# EAGLE design datalogger_1.1 (EAGLE 5.12)
DATABASE: /home/matthew/work/eagle/partsdb.txt; PARTNO: HSMH-C170
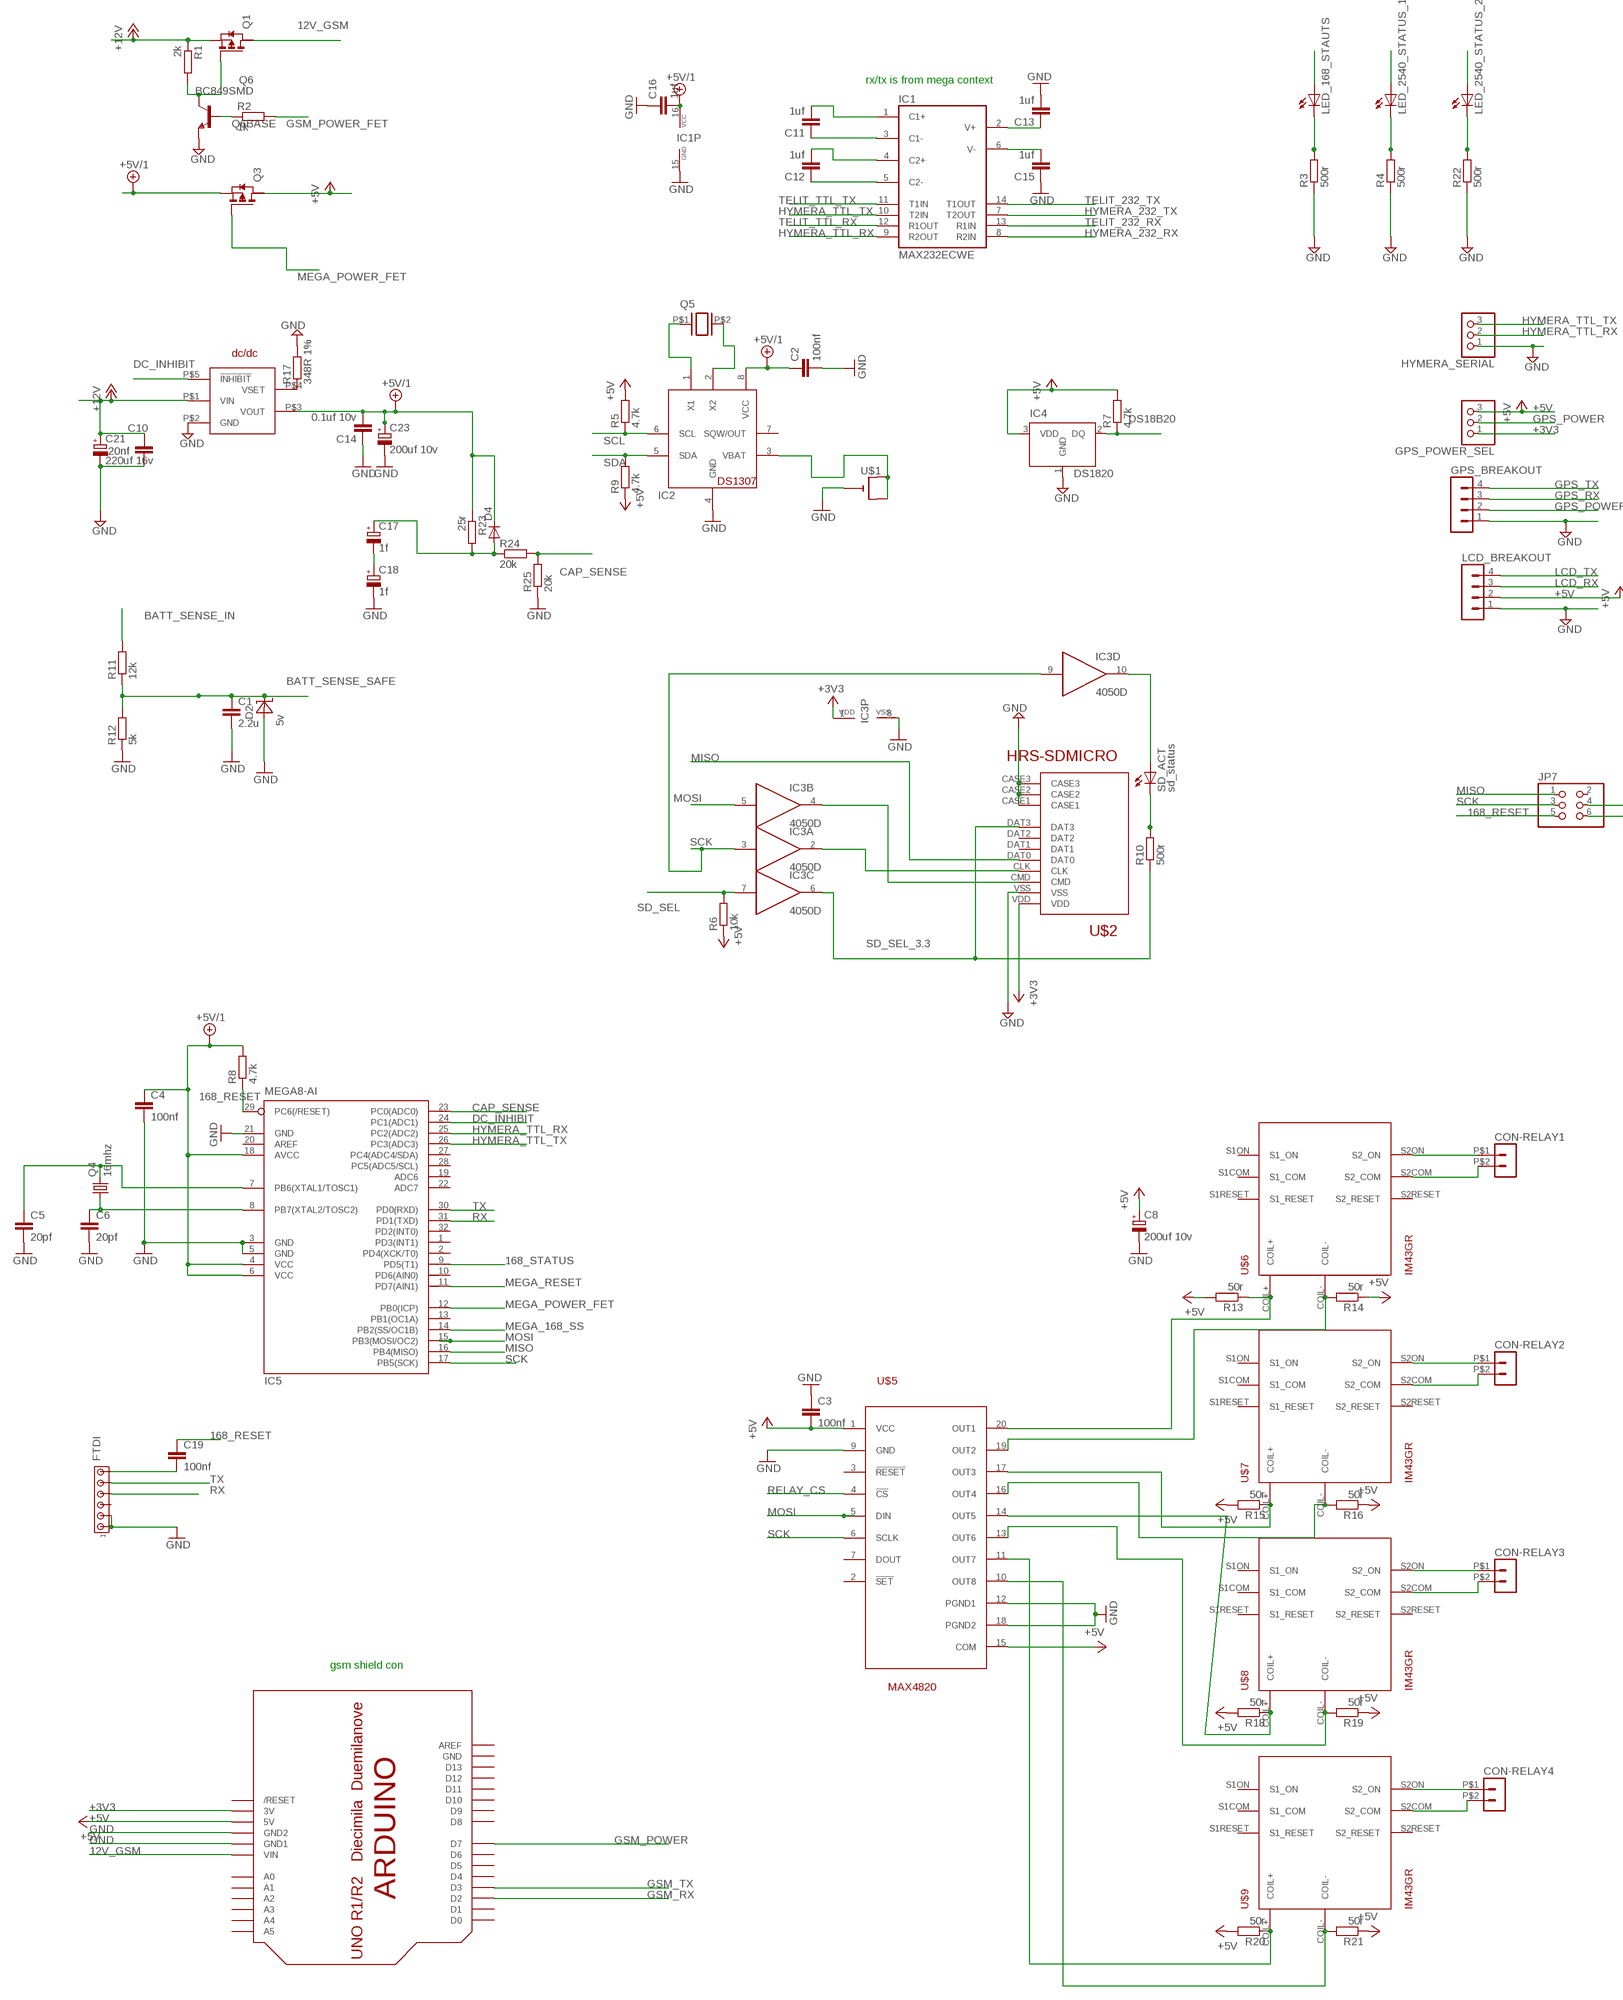
[diagram p0: schematic, sheet 1, part 1 of 3]
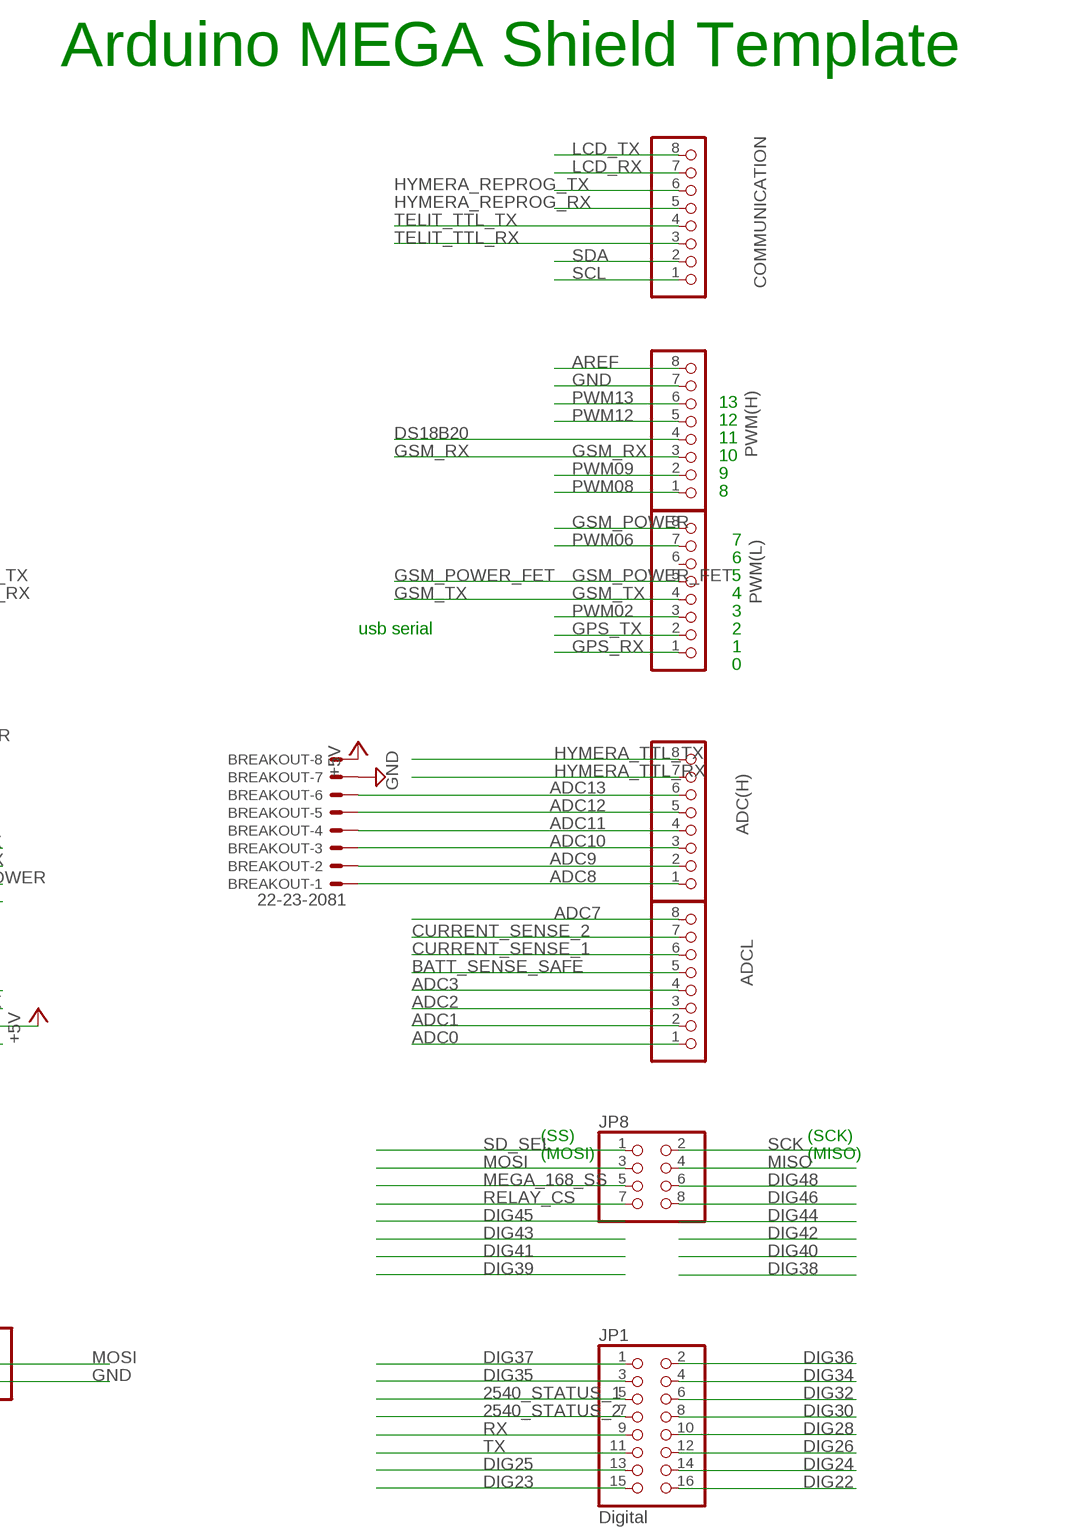
[diagram p1: schematic, sheet 1, part 2 of 3]
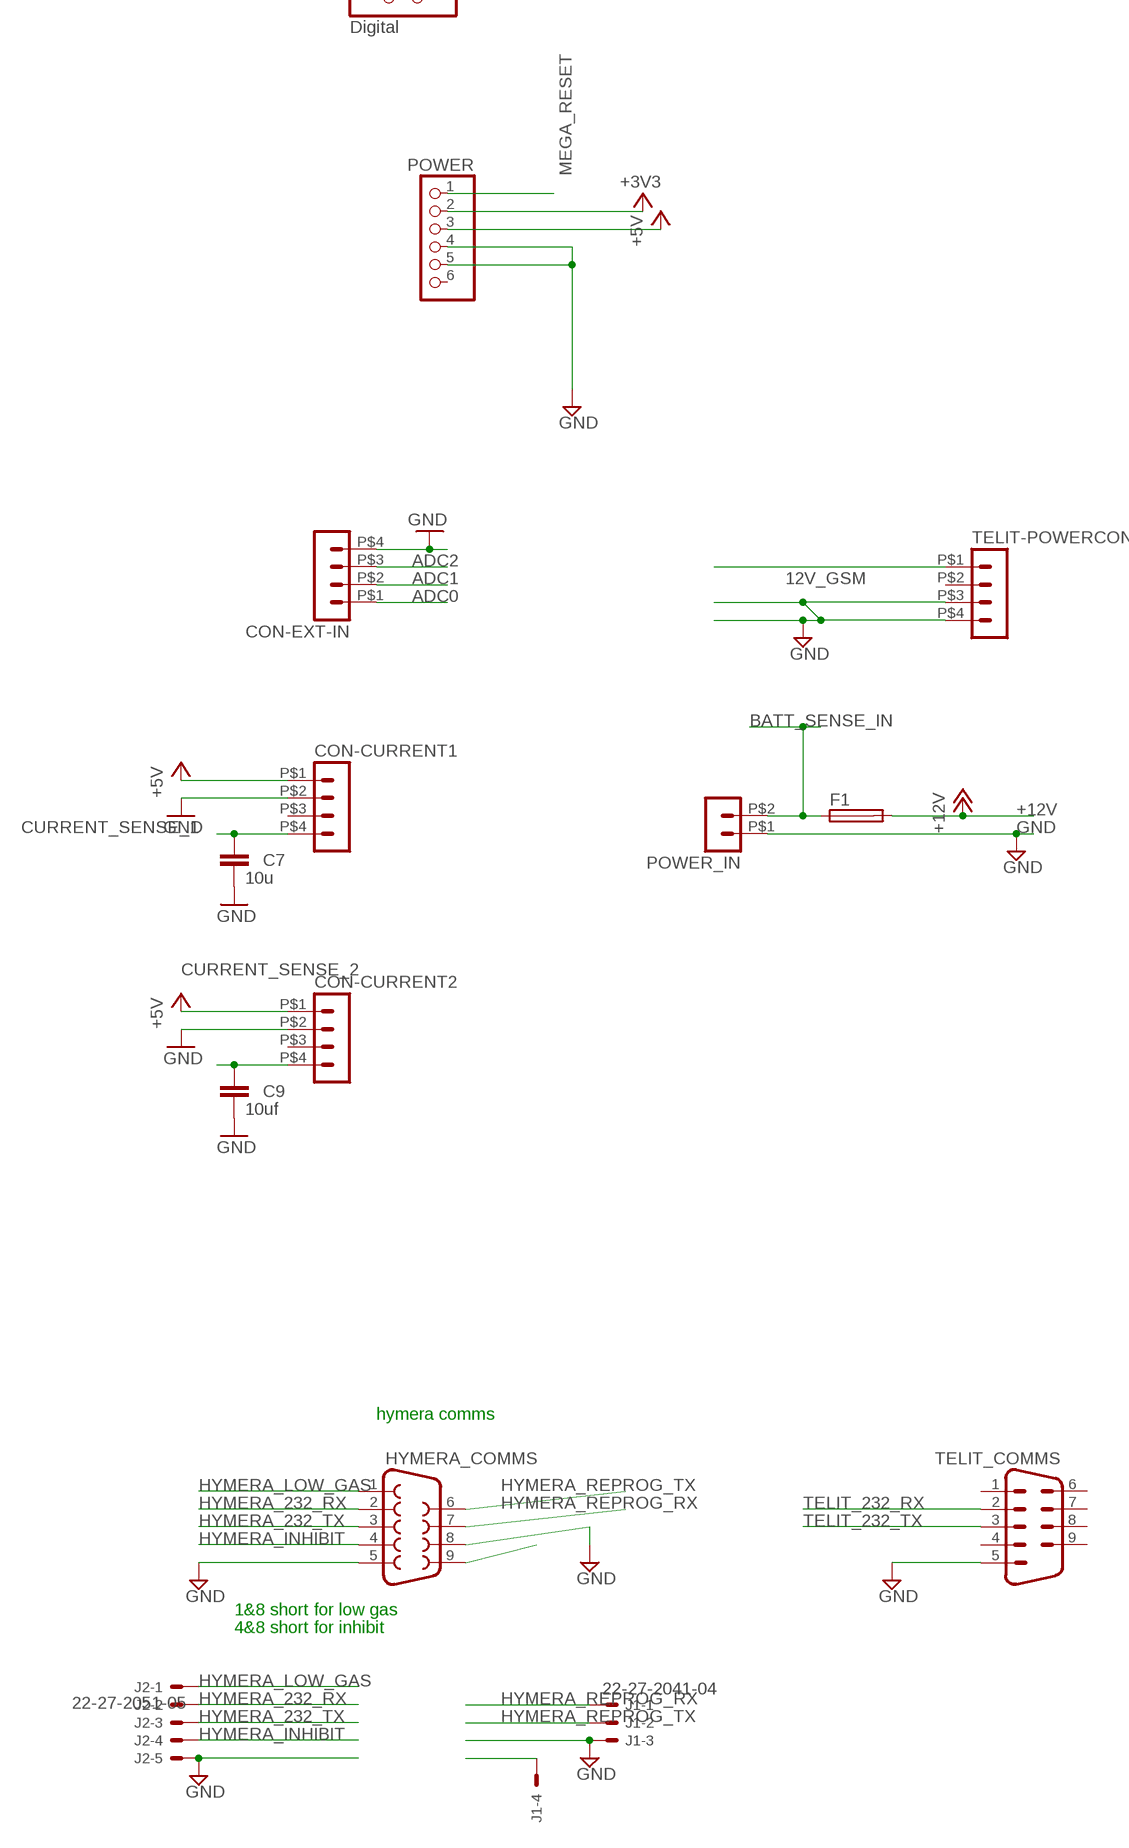
[diagram p2: schematic, sheet 1, part 3 of 3]

## Parts
ADC(H)  PINHD-1X8  [1X08]
ADCL  PINHD-1X8  [1X08]
BREAKOUT  22-23-2081  [22-23-2081]
C1  2.2u  C-EUC1206  [C1206]
C2  100nf  C-EUC1206  [C1206]
C3  100nf  C-EUC1206  [C1206]
C4  100nf  C-EUC1206  [C1206]
C5  20pf  C-EUC1206  [C1206]
C6  20pf  C-EUC1206  [C1206]
C7  10u  C-EUC1206  [C1206]
C8  200uf 10v  CPOL-EU153CLV-0505  [153CLV-0505]
C9  10uf  C-EUC1206  [C1206]
C10  20nf  C-EUC1206  [C1206]
C11  1uf  C-EUC1206  [C1206]
C12  1uf  C-EUC1206  [C1206]
C13  1uf  C-EUC1206  [C1206]
C14  0.1uf 10v  C-EUC1206  [C1206]
C15  1uf  C-EUC1206  [C1206]
C16  1uf  C-EUC1206  [C1206]
C17  1f  CPOL-EUE5-10.5  [E5-10,5]
C18  1f  CPOL-EUE5-10.5  [E5-10,5]
C19  100nf  C-EUC1206  [C1206]
C21  220uf 16v  CPOL-EU153CLV-0810  [153CLV-0810]
C23  200uf 10v  CPOL-EU153CLV-0505  [153CLV-0505]
COMMUNICATION  PINHD-1X8  [1X08]
CON-CURRENT1  HEADER_POS4_43045-0401  [43045-0400]
CON-CURRENT2  HEADER_POS4_43045-0401  [43045-0400]
CON-EXT-IN  HEADER_POS4_43045-0401  [43045-0400]
CON-RELAY1  HEADER_POS2_43045-0200  [43045-0200]
CON-RELAY2  HEADER_POS2_43045-0200  [43045-0200]
CON-RELAY3  HEADER_POS2_43045-0200  [43045-0200]
CON-RELAY4  HEADER_POS2_43045-0200  [43045-0200]
D2  5v  1206ZENER  [C1206]
D4  DIODE-DO214BA  [DO214BA]
F1  SH22,5  [SH22,5]
FTDI  MTA06-100  [10X06MTA]
GPS_BREAKOUT  MA04-1  [MA04-1]
GPS_POWER_SEL  PINHD-1X3  [1X03]
HYMERA_COMMS  F09H  [F09H]
HYMERA_SERIAL  PINHD-1X3  [1X03]
IC1  MAX232ECWE  [SO16L]
IC2  DS1307  DS1307SOO8  [SO08]
IC3  4050D  [SO16]
IC4  DS1820  [TO-92]
IC5  MEGA8-AI  [TQFP32-08]
J1  22-27-2041-04  [6410-04]
J2  22-27-2051-05  [6410-05]
JP1  Digital  PINHD-2X8  [2X08]
JP7  PINHD-2X3  [2X03]
JP8  PINHD-2X4  [2X04]
LCD_BREAKOUT  MA04-1  [MA04-1]
LED_168_STAUTS  sd_status  LEDSMT1206  [1206]
LED_2540_STATUS_1  sd_status  LEDSMT1206  [1206]
LED_2540_STATUS_2  sd_status  LEDSMT1206  [1206]
POWER  PINHD-1X6  [1X06]
POWER_IN  HEADER_POS2_43045-0200  [43045-0200]
PWM(H)  PINHD-1X8  [1X08]
PWM(L)  PINHD-1X8  [1X08]
Q1  PMOSSOT223  [SOT223]
Q3  PMOSSOT223  [SOT223]
Q4  16mhz  CRYSTALHC49UP  [HC49UP]
Q5  XTALSMT  [CC4VCRYSTAL]
Q6  BC849SMD  [SOT23-BEC]
R1  2k  R-EU_M1206  [M1206]
R2  1k  R-EU_M1206  [M1206]
R3  500r  R-EU_R1206  [R1206]
R4  500r  R-EU_R1206  [R1206]
R5  4.7k  R-EU_R1206  [R1206]
R6  10k  R-EU_R1206  [R1206]
R7  4.7k  R-EU_M1206  [M1206]
R8  4.7k  R-EU_R1206  [R1206]
R9  4.7k  R-EU_R1206  [R1206]
R10  500r  R-EU_R1206  [R1206]
R11  12k  R-EU_R1206  [R1206]
R12  5k  R-EU_R1206  [R1206]
R13  50r  R-EU_R1206  [R1206]
R14  50r  R-EU_R1206  [R1206]
R15  50r  R-EU_R1206  [R1206]
R16  50r  R-EU_R1206  [R1206]
R17  348R 1%  R-EU_R1206  [R1206]
R18  50r  R-EU_R1206  [R1206]
R19  50r  R-EU_R1206  [R1206]
R20  50r  R-EU_R1206  [R1206]
R21  50r  R-EU_R1206  [R1206]
R22  500r  R-EU_R1206  [R1206]
R23  25r  R-EU_R2512  [R2512]
R24  20k  R-EU_M1206  [M1206]
R25  20k  R-EU_M1206  [M1206]
SD_ACT  sd_status  LEDSMT1206  [1206]
TELIT-POWERCON  HEADER_POS4_43045-0401  [43045-0400]
TELIT_COMMS  M09H  [M09H]
U$1  CR1220SMT  [CR1220-SMD]
U$2  HRS-SDMICRO  [HRS-MICROSD]
U$3  ARDUINO-NODIM  [ARDUINO-NODIM]
U$4  PTH08080WAH  [PTH08080WAH]
U$5  MAX4820  [TSSOP20]
U$6  IM43GR  [IM43GR]
U$7  IM43GR  [IM43GR]
U$8  IM43GR  [IM43GR]
U$9  IM43GR  [IM43GR]

## Nets
12V_GSM [power]: Q1.2(D) TELIT-POWERCON.P$1 U$3.VIN
168_RESET: C19.1 IC5.29(PC6(/RESET)) JP7.5 R8.1
168_STATUS: IC5.9(PD5(T1)) LED_168_STAUTS.A
2540_STATUS_1: JP1.5 LED_2540_STATUS_1.A
2540_STATUS_2: JP1.7 LED_2540_STATUS_2.A
+3V3 [power]: GPS_POWER_SEL.1 IC3.1(P:VDD) POWER.2 U$2.VDD U$3.3V
+5V [power]: BREAKOUT.8 C3.2 C8.+ CON-CURRENT1.P$1 CON-CURRENT2.P$1 GPS_POWER_SEL.3 IC4.3(VDD) LCD_BREAKOUT.2 POWER.3 Q3.2(D) R5.2 R6.1 R7.2 R9.1 R13.2 R14.1 R15.2 R16.1 R18.2 R19.1 R20.2 R21.1 U$3.5V U$5.1(VCC) U$5.15(COM)
+5V/1 [power]: C2.1 C4.1 C14.2 C16.2 C23.+ D4.C IC1.16(VCC) IC2.8(VCC) IC5.4(VCC) IC5.6(VCC) IC5.18(AVCC) Q3.3(S) R8.2 R23.1 U$4.P$3(VOUT)
+12V [power]: C10.1 C21.+ F1.2 Q1.3(S) R1.1 U$4.P$1(VIN)
ADC0: ADCL.1 CON-EXT-IN.P$1
ADC1: ADCL.2 CON-EXT-IN.P$2
ADC2: ADCL.3 CON-EXT-IN.P$3
ADC3: ADCL.4
ADC7: ADCL.8
ADC8: ADC(H).1 BREAKOUT.1
ADC9: ADC(H).2 BREAKOUT.2
ADC10: ADC(H).3 BREAKOUT.3
ADC11: ADC(H).4 BREAKOUT.4
ADC12: ADC(H).5 BREAKOUT.5
ADC13: ADC(H).6 BREAKOUT.6
AREF: PWM(H).8
BATT_SENSE_IN [power]: F1.1 POWER_IN.P$2 R11.2
BATT_SENSE_SAFE: ADCL.5 C1.1 D2.CATHODE(C) R11.1 R12.2
CAP_SENSE: IC5.23(PC0(ADC0)) R24.2 R25.2
CURRENT_SENSE_1: ADCL.6 C7.1 CON-CURRENT1.P$4
CURRENT_SENSE_2: ADCL.7 C9.1 CON-CURRENT2.P$4
DC_INHIBIT: IC5.24(PC1(ADC1)) U$4.P$5(!INHIBIT)
DIG22: JP1.16
DIG23: JP1.15
DIG24: JP1.14
DIG25: JP1.13
DIG26 [gnd]: JP1.12
DIG28: JP1.10
DIG30: JP1.8
DIG32: JP1.6
DIG34: JP1.4
DIG35: JP1.3
DIG36: JP1.2
DIG37: JP1.1
DIG46: JP8.8
DIG48: JP8.6
DS18B20: IC4.2(DQ) PWM(H).4 R7.1
GND [gnd]: BREAKOUT.7 C1.2 C2.2 C3.1 C4.2 C5.2 C6.2 C7.2 C8.- C9.2 C10.2 C13.2 C14.1 C15.1 C16.1 C18.- C21.- C23.- CON-CURRENT1.P$2 CON-CURRENT2.P$2 CON-EXT-IN.P$4 D2.ANODE(A) FTDI.5 FTDI.6 GPS_BREAKOUT.1 HYMERA_COMMS.5 HYMERA_COMMS.8 HYMERA_SERIAL.1 IC1.15(GND) IC2.4(GND) IC3.8(P:VSS) IC4.1(GND) IC5.3(GND) IC5.5(GND) IC5.21(GND) J1.3 J2.5 JP7.6 LCD_BREAKOUT.1 POWER.4 POWER.5 POWER_IN.P$1 PWM(H).7 Q6.E R3.1 R4.1 R12.1 R17.2 R22.1 R25.1 TELIT-POWERCON.P$3 TELIT-POWERCON.P$4 TELIT_COMMS.5 U$1.- U$2.CASE1 U$2.CASE2 U$2.CASE3 U$2.VSS U$3.GND1 U$3.GND2 U$4.P$2(GND) U$5.9(GND) U$5.12(PGND1) U$5.18(PGND2)
GPS_POWER: GPS_BREAKOUT.2 GPS_POWER_SEL.2
GPS_RX: GPS_BREAKOUT.3 PWM(L).1
GPS_TX: GPS_BREAKOUT.4 PWM(L).2
GSM_POWER: PWM(L).8 U$3.D7
GSM_POWER_FET: PWM(L).5 R2.2
GSM_RX: PWM(H).3 U$3.D2
GSM_TX: PWM(L).4 U$3.D3
HYMERA_9: HYMERA_COMMS.9 J1.4
HYMERA_232_RX: HYMERA_COMMS.2 IC1.8(R2IN) J2.2
HYMERA_232_TX: HYMERA_COMMS.3 IC1.7(T2OUT) J2.3
HYMERA_INHIBIT: HYMERA_COMMS.4 J2.4
HYMERA_LOW_GAS: HYMERA_COMMS.1 J2.1
HYMERA_REPROG_RX: COMMUNICATION.5 HYMERA_COMMS.7 J1.1
HYMERA_REPROG_TX: COMMUNICATION.6 HYMERA_COMMS.6 J1.2
HYMERA_TTL_RX: ADC(H).7 HYMERA_SERIAL.2 IC1.9(R2OUT) IC5.25(PC2(ADC2))
HYMERA_TTL_TX: ADC(H).8 HYMERA_SERIAL.3 IC1.10(T2IN) IC5.26(PC3(ADC3))
LCD_RX: COMMUNICATION.7 LCD_BREAKOUT.3
LCD_TX: COMMUNICATION.8 LCD_BREAKOUT.4
MEGA_168_SS: IC5.14(PB2(SS/OC1B)) JP8.5
MEGA_POWER_FET: IC5.12(PB0(ICP)) Q3.1(G)
MEGA_RESET: IC5.11(PD7(AIN1)) POWER.1
MISO: IC5.16(PB4(MISO)) JP7.1 JP8.4 U$2.DAT0
MOSI: IC3.5(B:I) IC5.15(PB3(MOSI/OC2)) JP7.4 JP8.3 U$5.5(DIN)
MOSI_3.3: IC3.4(B:O) U$2.CMD
N$1 [power]: C17.- C18.+
N$2: Q1.1(G) Q6.C R1.2
N$3: C19.2 FTDI.1
N$4: CON-RELAY1.P$1 U$6.S2ON(S2_ON)
N$5: R17.1 U$4.P$4(VSET)
N$6: IC2.1(X1) Q5.P$1
N$7: IC2.3(VBAT) U$1.+$1(+) U$1.+$2(+1)
N$8: C6.1 IC5.8(PB7(XTAL2/TOSC2)) Q4.1
N$9: IC2.2(X2) Q5.P$2
N$10: IC3.10(D:O) SD_ACT.A
N$11: C5.1 IC5.7(PB6(XTAL1/TOSC1)) Q4.2
N$12: CON-RELAY1.P$2 U$6.S2COM(S2_COM)
N$13: LED_168_STAUTS.C R3.2
N$14: CON-RELAY2.P$1 U$7.S2ON(S2_ON)
N$15: CON-RELAY2.P$2 U$7.S2COM(S2_COM)
N$16: CON-RELAY3.P$1 U$8.S2ON(S2_ON)
N$17: CON-RELAY3.P$2 U$8.S2COM(S2_COM)
N$18: R10.2 SD_ACT.C
N$19: CON-RELAY4.P$1 U$9.S2ON(S2_ON)
N$20: CON-RELAY4.P$2 U$9.S2COM(S2_COM)
N$21: R13.1 U$5.20(OUT1) U$6.COIL+
N$22: R14.2 U$5.19(OUT2) U$6.COIL-
N$23: R15.1 U$5.17(OUT3) U$7.COIL+
N$24: R16.2 U$5.16(OUT4) U$7.COIL-
N$25: R18.1 U$5.14(OUT5) U$8.COIL+
N$26: R19.2 U$5.13(OUT6) U$8.COIL-
N$27: R20.1 U$5.11(OUT7) U$9.COIL+
N$28: R21.2 U$5.10(OUT8) U$9.COIL-
N$30: C12.1 IC1.5(C2-)
N$31: C12.2 IC1.4(C2+)
N$32: C11.1 IC1.3(C1-)
N$33: C11.2 IC1.1(C1+)
N$34: C13.1 IC1.2(V+)
N$35: C15.2 IC1.6(V-)
N$36: LED_2540_STATUS_1.C R4.2
N$38: LED_2540_STATUS_2.C R22.2
PWM02: PWM(L).3
PWM06: PWM(L).7
PWM08: PWM(H).1
PWM09: PWM(H).2
PWM12: PWM(H).5
PWM13: PWM(H).6
Q6BASE: Q6.B R2.1
RELAY_CS: JP8.7 U$5.4(!CS)
RX: FTDI.3 IC5.31(PD1(TXD)) JP1.9
SCK: IC3.3(A:I) IC3.9(D:I) IC5.17(PB5(SCK)) JP7.3 JP8.2 U$5.6(SCLK)
SCK_3.3: IC3.2(A:O) U$2.CLK
SCL: COMMUNICATION.1 IC2.6(SCL) R5.1
SD_SEL: IC3.7(C:I) JP8.1 R6.2
SD_SEL_3.3: IC3.6(C:O) R10.1 U$2.DAT3
SDA: COMMUNICATION.2 IC2.5(SDA) R9.2
TELIT_232_RX: IC1.13(R1IN) TELIT_COMMS.2
TELIT_232_TX: IC1.14(T1OUT) TELIT_COMMS.3
TELIT_TTL_RX: COMMUNICATION.3 IC1.12(R1OUT)
TELIT_TTL_TX: COMMUNICATION.4 IC1.11(T1IN)
TX: FTDI.2 IC5.30(PD0(RXD)) JP1.11
X: C17.+ D4.A R23.2 R24.1
Unconnected: CON-CURRENT1.P$3 CON-CURRENT2.P$3 FTDI.4 IC2.7(SQW/OUT) IC3.11(E:I) IC3.12(E:O) IC3.14(F:I) IC3.15(F:O) IC5.1(PD3(INT1)) IC5.2(PD4(XCK/T0)) IC5.10(PD6(AIN0)) IC5.13(PB1(OC1A)) IC5.19(ADC6) IC5.20(AREF) IC5.22(ADC7) IC5.27(PC4(ADC4/SDA)) IC5.28(PC5(ADC5/SCL)) IC5.32(PD2(INT0)) JP7.2 POWER.6 PWM(L).6 Q1.4(D2) Q3.4(D2) TELIT-POWERCON.P$2 TELIT_COMMS.1 TELIT_COMMS.4 TELIT_COMMS.6 TELIT_COMMS.7 TELIT_COMMS.8 TELIT_COMMS.9 U$2.DAT1 U$2.DAT2 U$3.A0 U$3.A1 U$3.A2 U$3.A3 U$3.A4 U$3.A5 U$3.AREF U$3.D0 U$3.D1 U$3.D4 U$3.D5 U$3.D6 U$3.D8 U$3.D9 U$3.D10 U$3.D11 U$3.D12 U$3.D13 U$3.RESET(/RESET) U$5.2(!SET) U$5.3(!RESET) U$5.7(DOUT) U$6.S1COM(S1_COM) U$6.S1ON(S1_ON) U$6.S1RESET(S1_RESET) U$6.S2RESET(S2_RESET) U$7.S1COM(S1_COM) U$7.S1ON(S1_ON) U$7.S1RESET(S1_RESET) U$7.S2RESET(S2_RESET) U$8.S1COM(S1_COM) U$8.S1ON(S1_ON) U$8.S1RESET(S1_RESET) U$8.S2RESET(S2_RESET) U$9.S1COM(S1_COM) U$9.S1ON(S1_ON) U$9.S1RESET(S1_RESET) U$9.S2RESET(S2_RESET)

## Notes on the sheet
- Arduino MEGA Shield Template
- rx/tx is from mega context
- 13
- 12
- 11
- 10
- 9
- 8
- 7
- 6
- 5
- 4
- 3
- usb serial | 2
- 1
- 0
- (SS) | (SCK)
- (MOSI) | (MISO)
- gsm shield con
- hymera comms
- 1&8 short for low gas
- 4&8 short for inhibit

## Power pins joined to a net without a drawn wire
GND: U$3.GND

## Library data of the parts
ADC(H) ADCL COMMUNICATION PWM(H) PWM(L) = pinhead:PINHD-1X8: PIN HEADER
BREAKOUT = con-molex:22-23-2081: .100" (2.54mm) Center Header - 8 Pin; MF: MOLEX; MPN: 22-23-2081; OC_FARNELL: 1756826; OC_NEWARK: 01C7592
C1-C7 C9 C11-C13 C15 C16 C19 = matt rcl:C-EU: CAPACITOR, European symbol
C8 C23 = rcl:CPOL-EU: POLARIZED CAPACITOR, European symbol
C10 C14 = resistor:C-EU: CAPACITOR, European symbol
C17 C18 C21 = matt rcl:CPOL-EU: POLARIZED CAPACITOR, European symbol
CON-CURRENT1 CON-CURRENT2 CON-EXT-IN TELIT-POWERCON = con-molex-5569:HEADER_POS4_?: Molex - Micro-Fit 3.0 Series connector, 3.00mm (0.118") pitch header, 4 positions.
CON-RELAY1-CON-RELAY4 POWER_IN = con-molex-5569:HEADER_POS2_?: Molex - Micro-Fit 3.0 Series connector, 3.00mm (0.118") pitch header, 2 positions.
D2 = matt diode:1206ZENER
D4 = matt diode:DIODE-: DIODE
F1 = fuse:SH22,5: FUSE HOLDER grid 22,5 mm, OGN0031 8201, Schurter (Buerklin); MF: SCHURTER; MPN: 0031.8201; OC_FARNELL: 1162740; OC_NEWARK: 96F8317
FTDI = matt con-amp:MTA06-100: AMP connector
GPS_BREAKOUT LCD_BREAKOUT = con-lstb:MA04-1: PIN HEADER; OC_FARNELL: unknown; OC_NEWARK: unknown
GPS_POWER_SEL HYMERA_SERIAL = adafruit:PINHD-1X3: PIN HEADER
HYMERA_COMMS = con-subd:F09: SUB-D; OC_FARNELL: unknown; OC_NEWARK: unknown
IC1 = maxim:MAX232ECWE: RS232 TRANSEIVER; MF: MAXIM; MPN: MAX232ECWE+; OC_FARNELL: 9724435; OC_NEWARK: 67K4440
IC2 = adafruit:DS1307: DS1307 Real time clock (RTC) with battery backup ability. Talk to it via i2c
IC3 = 40xx:4050: Hex non-inverting BUFFER
IC4 = DS1820:DS1820: DS1820 - 1-Wire Digital Thermometer
IC5 = matt atmel:MEGA8: MICROCONTROLLER 8 Kbytes FLASH, 1 kbytes SRAM, 512 bytes EEPROM, USART, 6-channel 10 bit ADC, 2-channel 8 bit ADC Pin compatible with Atmega48, ATMega88, ATMega168 Source: avr.lbr
J1 = con-molex:22-?-04: CONNECTOR wire to board 2.54 mm (.1 inch) pitch header; OC_FARNELL: unknown; OC_NEWARK: unknown
J2 = con-molex:22-?-05: CONNECTOR wire to board 2.54 mm (.1 inch) pitch header; OC_FARNELL: unknown; OC_NEWARK: unknown
JP1 = pinhead:PINHD-2X8: PIN HEADER
JP7 = pinhead:PINHD-2X3: PIN HEADER
JP8 = pinhead:PINHD-2X4: PIN HEADER
LED_168_STAUTS LED_2540_STATUS_1 LED_2540_STATUS_2 SD_ACT = matt led:LED: LED OSRAM: - CHIPLED LG R971, LG N971, LY N971, LG Q971, LY Q971, LO R971, LY R971 LH N974, LH R974 LS Q976, LO Q976, LY Q976 LO Q996 - Hyper CHIPLED LW Q18S LB Q993, LB Q99A, LB R99A - SideLED LS A670, LO A670, LY A670, LG A670, LP A670 LB A673, LV A673, LT A673, LW A673 LH A674 LY A675 LS A676, LA A676, LO A676, LY A676, LW A676 LS A679, LY A679, LG A679 - Hyper Micro SIDELED® LS Y876, LA Y876, LO Y876, LY Y876 LT Y87S - SmartLED LW L88C, LW L88S LB L89C, LB L89S, LG L890 LS L89K, LO L89K, LY L89K LS L896, LA L896, LO L896, LY L896 - TOPLED LS T670, LO T670, LY T670, LG T670, LP T670 LSG T670, LSP T670, LSY T670, LOP T670, LYG T670 LG T671, LOG T671, LSG T671 LB T673, LV T673, LT T673, LW T673 LH T674 LS T676, LA T676, LO T676, LY T676, LB T676, LH T676, LSB T676, LW T676 LB T67C, LV T67C, LT T67C, LS T67K, LO T67K, LY T67K, LW E67C LS E67B, LA E67B, LO E67B, LY E67B, LB E67C, LV E67C, LT E67C LW T67C LS T679, LY T679, LG T679 LS T770, LO T770, LY T770, LG T770, LP T770 LB T773, LV T773, LT T773, LW T773 LH T774 LS E675, LA E675, LY E675, LS T675 LS T776, LA T776, LO T776, LY T776, LB T776 LHGB T686 LT T68C, LB T68C - Hyper Mini TOPLED® LB M676 - Mini TOPLED Santana® LG M470 LS M47K, LO M47K, LY M47K Source: http://www.osram.convergy.de LUXEON: - LUMILED® LXK2-PW12-R00, LXK2-PW12-S00, LXK2-PW14-U00, LXK2-PW14-V00 LXK2-PM12-R00, LXK2-PM12-S00, LXK2-PM14-U00 LXK2-PE12-Q00, LXK2-PE12-R00, LXK2-PE12-S00, LXK2-PE14-T00, LXK2-PE14-U00 LXK2-PB12-K00, LXK2-PB12-L00, LXK2-PB12-M00, LXK2-PB14-N00, LXK2-PB14-P00, LXK2-PB14-Q00 LXK2-PR12-L00, LXK2-PR12-M00, LXK2-PR14-Q00, LXK2-PR14-R00 LXK2-PD12-Q00, LXK2-PD12-R00, LXK2-PD12-S00 LXK2-PH12-R00, LXK2-PH12-S00 LXK2-PL12-P00, LXK2-PL12-Q00, LXK2-PL12-R00 Source: www.luxeon.com KINGBRIGHT: KA-3528ASYC Source: www.kingbright.com
POWER = pinhead:PINHD-1X6: PIN HEADER
Q1 Q3 = zetex:PMOSSOT223: MOS FET; OC_FARNELL: unknown; OC_NEWARK: unknown
Q4 = crystal:CRYSTAL: CRYSTAL; OC_FARNELL: unknown; OC_NEWARK: unknown
Q5 = matt special:XTAL: CRYSTAL
Q6 = matt transistor-npn:BC849*: NPN Transistor
R1 R2 R7 R24 R25 = resistor:R-EU_: RESISTOR, European symbol
R3-R6 R8-R23 = matt rcl:R-EU_: RESISTOR, European symbol
TELIT_COMMS = con-subd:M09: SUB-D; OC_FARNELL: unknown; OC_NEWARK: unknown
U$1 = adafruit:CR1220: CR1216/CR1220/CR1225 12mm 3V lithium coin cell Great for battery packup. Both SMT and THM holders. Note the THM package has the ground pads on both sides of the PCB so that the masks are the same - this reduces the cost
U$2 = matt:HRS-SDMICRO
U$3 = adafruit:ARDUINO: Arduino Diecimila/Duemilanove Make a shield with ease, this package has all the named pins as well as the two mounting drill holes and an outline of the USB and DC power connector. The outline is on the DIMENSION layer, so if your board house uses it they will cut the outline to match. http://www.ladyada.net/library/pcb/eaglelibrary.html
U$4 = matt:PTH08080WAH
U$5 = matt:MAX4820
U$6-U$9 = matt:IM43GR

## Net classes
1 power: width 0.508 mm
2 gnd: width 0.508 mm, drill 0.711 mm, clearance 0.203 mm
3 usbvcc: width 0.508 mm, drill 0.711 mm, clearance 0.203 mm

## Board
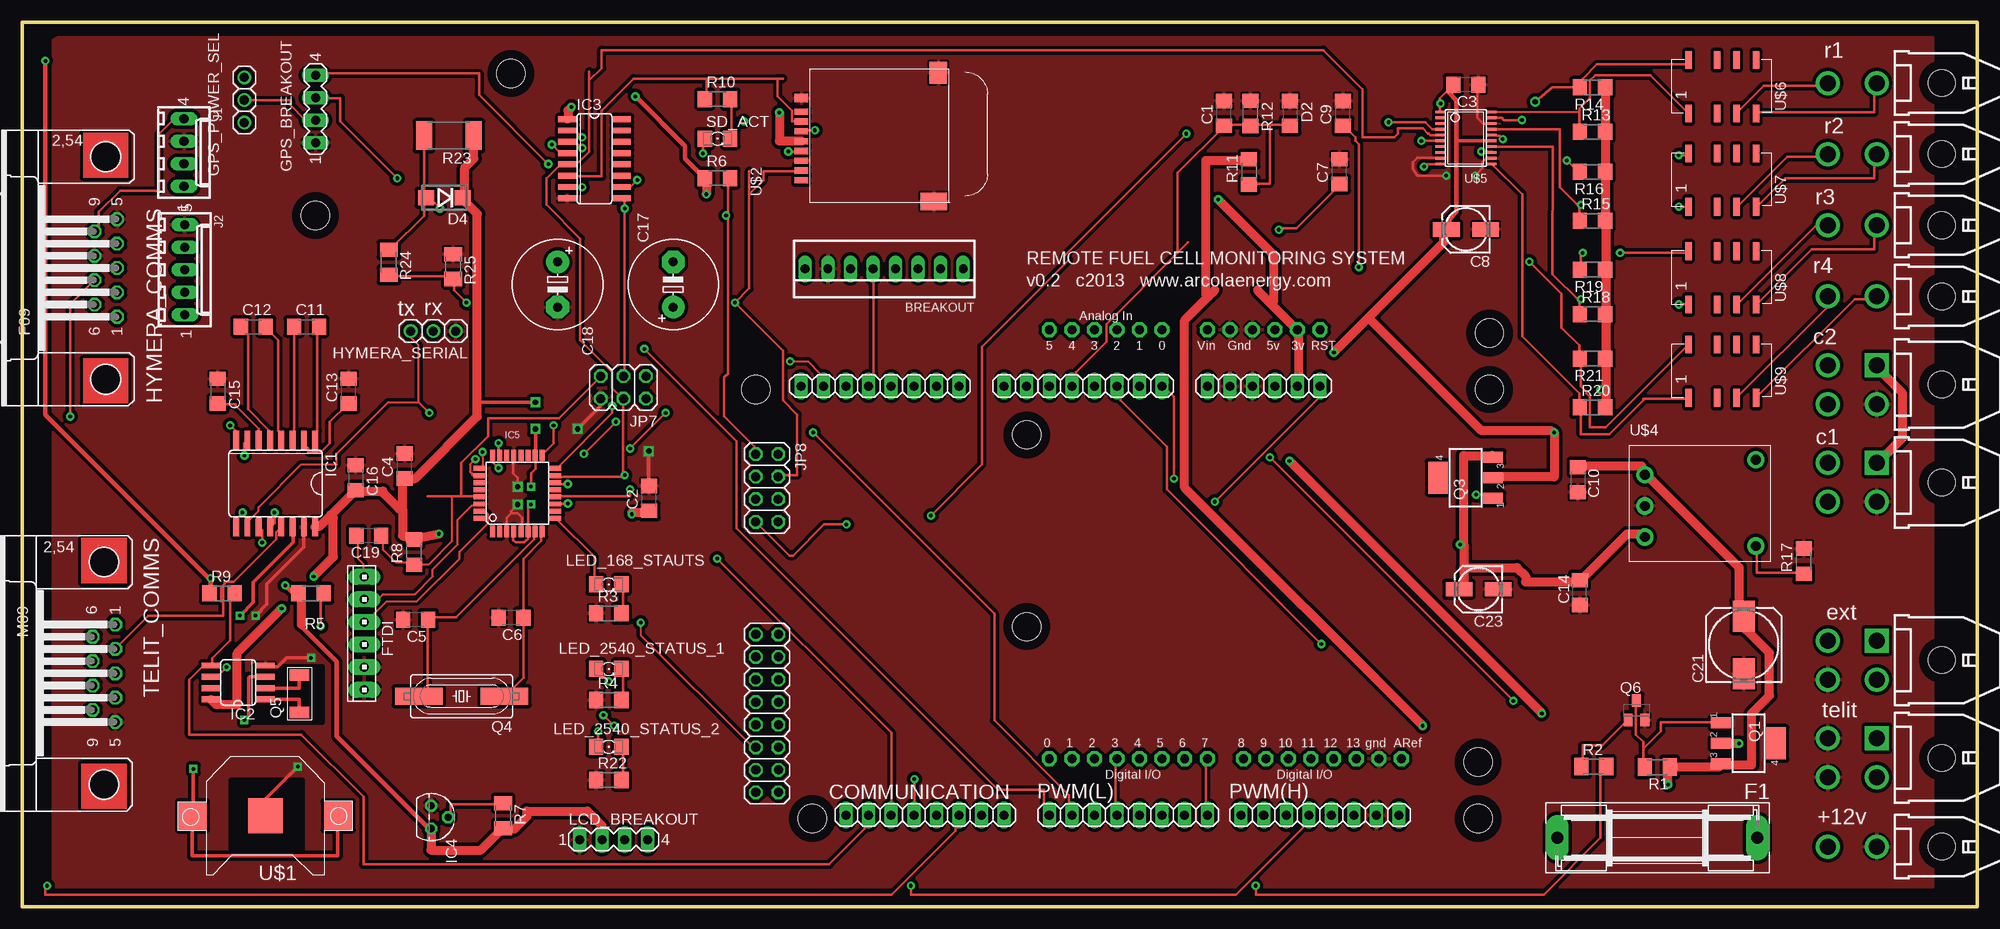
[diagram p3: board, top side]
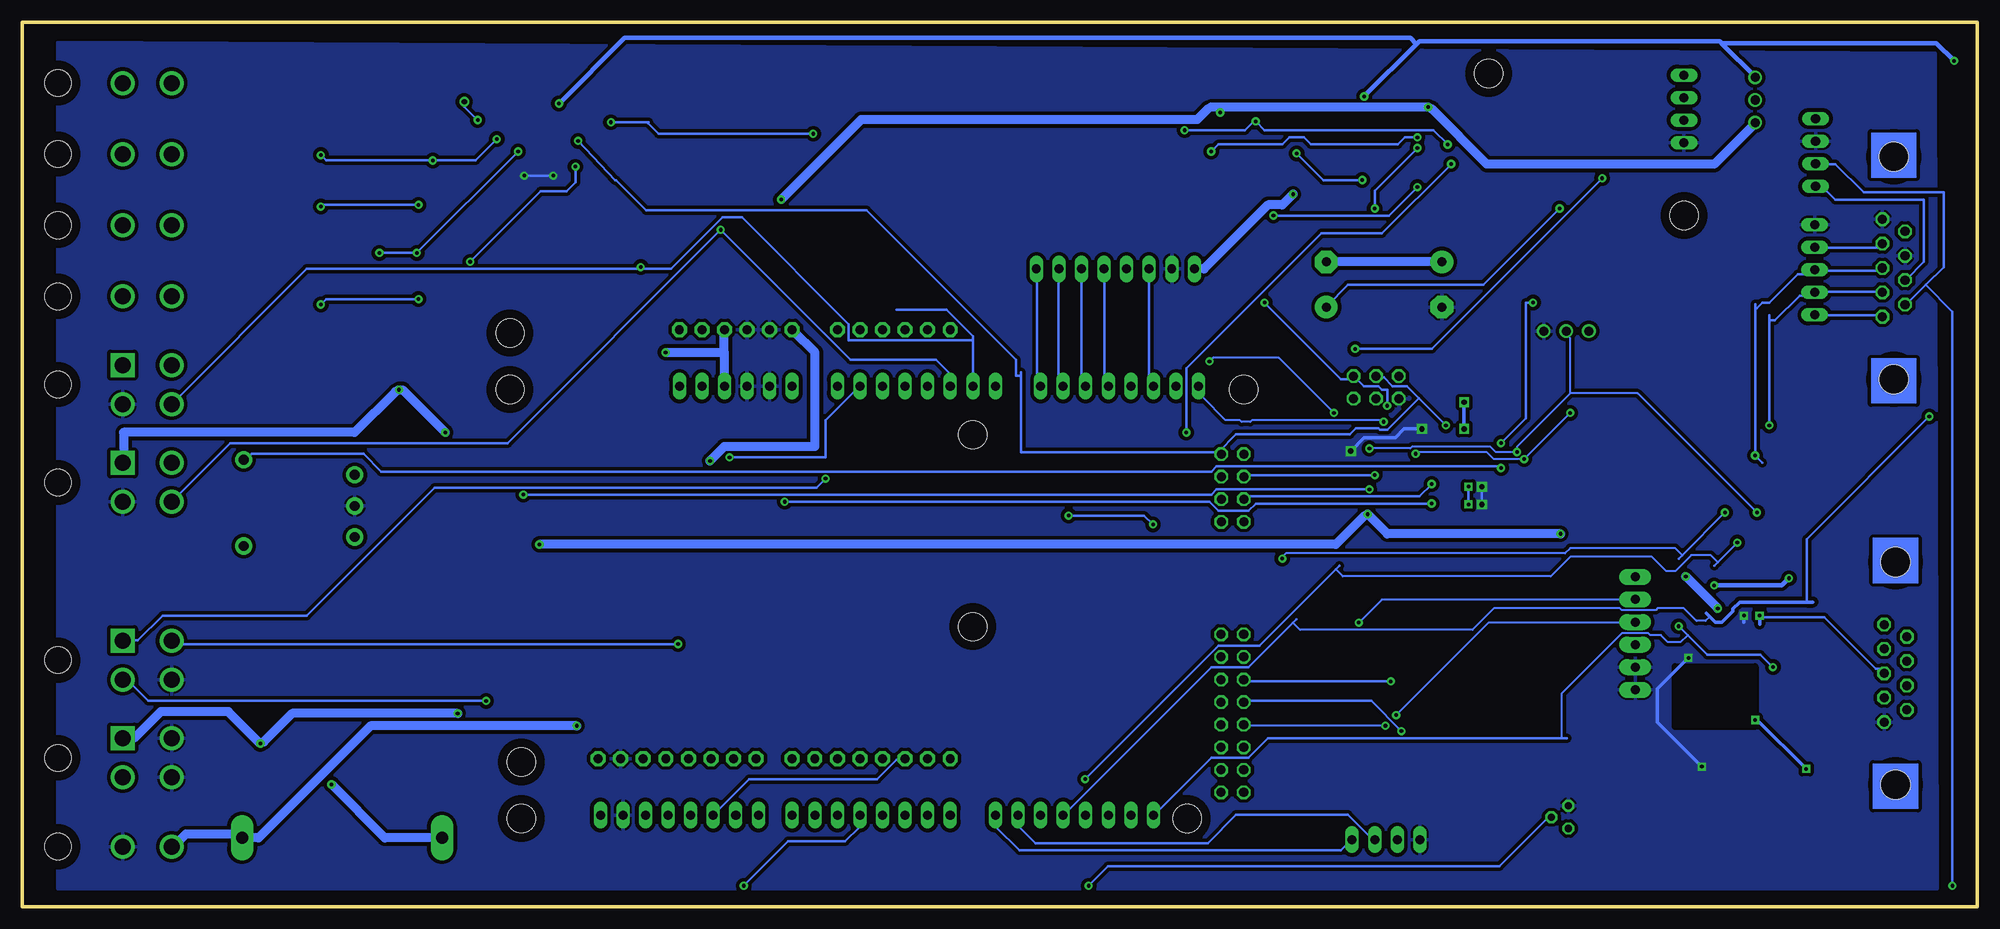
[diagram p4: board, bottom side, seen from below]

Size 220 x 99.5 mm. Coordinates in mm from the lower left corner, seen from the top.
Outline: 0,99.5 0,0 220,0 220,99.5 0,99.5
Copper layers (1*16): Top 0.035mm / dielectric 1.5mm / Bottom 0.035mm
Design rules "default *": minimum track width 8mil, minimum drill 16mil, track to track 15mil, track to pad 8mil, pad to pad 8mil, via to via 8mil, smd to smd 8mil, copper to edge 40mil, drill to drill 12mil, minimum pad ring 10mil, minimum via ring 10mil, stop-mask expansion 4mil, vias tented up to drill 0mil, thermal gap 10mil
Holes 3.2 mm at 55,93.75 33,77.75 165.1,58.17 113.03,53.09 82.55,58.17 88.9,9.91 163.83,9.91 163.83,16.26 165.1,64.52 113.03,31.5
tRestrict: area 26,20.8 to 33.8,27; area 23.5,6.2 to 31.5,14.2
bRestrict: area 25,20.2 to 34,27

### Footprints (pad centres in the part's own frame; a part is rotated, then mirrored left to right if it is on the bottom)
1X08 = drill 1.016 long: 1 -8.89,0; 2 -6.35,0; 3 -3.81,0; 4 -1.27,0; 5 1.27,0; 6 3.81,0; 7 6.35,0; 8 8.89,0
22-23-2081 = drill 1 long: 1 -8.89,0; 2 -6.35,0; 3 -3.81,0; 4 -1.27,0; 5 1.27,0; 6 3.81,0; 7 6.35,0; 8 8.89,0
C1206 = smd 1.6 x 1.8: 1 -1.4,0; 2 1.4,0
153CLV-0505 = smd 3 x 1.6: + 2.2,0; - -2.2,0
E5-10,5 = drill 1.016 pad 2.54 round: + -2.54,0 | drill 1.016 pad 2.54 octagon: - 2.54,0
153CLV-0810 = smd 3.5 x 2.5: + 3.25,0; - -3.25,0
43045-0400 = drill 1.8 square: P$1 2.2,7.3 | drill 1.8 round: P$2 -2.2,7.3; P$3 2.2,12.8; P$4 -2.2,12.8 | hole 3: 0,0
43045-0200 = drill 1.8 round: P$1 0,7.32; P$2 0,12.82 | hole 3: 0,0
C1206' = smd 1.6 x 1.8: ANODE -1.4,0; CATHODE 1.4,0
DO214BA = smd 1.8 x 1.7: A 2.05,0; C -2.05,0
SH22,5 = drill 1.321 pad 2.54 long: 1 -11.252,0; 2 11.252,0
10X06MTA = drill 1.016 pad 1.778 long: 1 6.35,0; 2 3.81,0; 3 1.27,0; 4 -1.27,0; 5 -3.81,0; 6 -6.35,0
MA04-1 = drill 1.016 long: 1 -3.81,0; 2 -1.27,0; 3 1.27,0; 4 3.81,0
1X03 = drill 1.016 round: 1 -2.54,0; 2 0,0; 3 2.54,0
F09H = drill 1.016 octagon: 1 -5.486,-1.27; 2 -2.743,-1.27; 3 0,-1.27; 4 2.743,-1.27; 5 5.486,-1.27; 6 -4.115,1.27; 7 -1.372,1.27; 8 1.372,1.27; 9 4.115,1.27 | hole 3.302: -12.522,0; 12.522,0
SO16L = smd 0.66 x 2.032: 1 -4.445,-4.902; 2 -3.175,-4.902; 3 -1.905,-4.902; 4 -0.635,-4.902; 5 0.635,-4.902; 6 1.905,-4.902; 7 3.175,-4.902; 8 4.445,-4.902; 9 4.445,4.902; 10 3.175,4.902; 11 1.905,4.902; 12 0.635,4.902; 13 -0.635,4.902; 14 -1.905,4.902; 15 -3.175,4.902; 16 -4.445,4.902
SO08 = smd 0.66 x 2.032: 1 -1.905,-3.073; 2 -0.635,-3.073; 3 0.635,-3.073; 4 1.905,-3.073; 5 1.905,3.073; 6 0.635,3.073; 7 -0.635,3.073; 8 -1.905,3.073
SO16 = smd 0.66 x 2.032: 1 -4.445,-3.073; 2 -3.175,-3.073; 3 -1.905,-3.073; 4 -0.635,-3.073; 5 0.635,-3.073; 6 1.905,-3.073; 7 3.175,-3.073; 8 4.445,-3.073; 9 4.445,3.073; 10 3.175,3.073; 11 1.905,3.073; 12 0.635,3.073; 13 -0.635,3.073; 14 -1.905,3.073; 15 -3.175,3.073; 16 -4.445,3.073
TO-92 = drill 0.813 pad 1.27 octagon: 1 -1.27,0; 2 0,1.905; 3 1.27,0
TQFP32-08 = smd 1.27 x 0.559: 1 -4.293,2.8; 2 -4.293,2; 3 -4.293,1.2; 4 -4.293,0.4; 5 -4.293,-0.4; 6 -4.293,-1.2; 7 -4.293,-2; 8 -4.293,-2.8; 17 4.293,-2.8; 18 4.293,-2; 19 4.293,-1.2; 20 4.293,-0.4; 21 4.293,0.4; 22 4.293,1.2; 23 4.293,2; 24 4.293,2.8 | smd 0.559 x 1.27: 9 -2.8,-4.293; 10 -2,-4.293; 11 -1.2,-4.293; 12 -0.4,-4.293; 13 0.4,-4.293; 14 1.2,-4.293; 15 2,-4.293; 16 2.8,-4.293; 25 2.8,4.293; 26 2,4.293; 27 1.2,4.293; 28 0.4,4.293; 29 -0.4,4.293; 30 -1.2,4.293; 31 -2,4.293; 32 -2.8,4.293
6410-04 = drill 1.016 long: 1 3.81,0; 2 1.27,0; 3 -1.27,0; 4 -3.81,0
6410-05 = drill 1.016 long: 1 5.08,0; 2 2.54,0; 3 0,0; 4 -2.54,0; 5 -5.08,0
2X08 = drill 1.016 octagon: 1 -8.89,-1.27; 2 -8.89,1.27; 3 -6.35,-1.27; 4 -6.35,1.27; 5 -3.81,-1.27; 6 -3.81,1.27; 7 -1.27,-1.27; 8 -1.27,1.27; 9 1.27,-1.27; 10 1.27,1.27; 11 3.81,-1.27; 12 3.81,1.27; 13 6.35,-1.27; 14 6.35,1.27; 15 8.89,-1.27; 16 8.89,1.27
2X03 = drill 1.016 octagon: 1 -2.54,-1.27; 2 -2.54,1.27; 3 0,-1.27; 4 0,1.27; 5 2.54,-1.27; 6 2.54,1.27
2X04 = drill 1.016 octagon: 1 -3.81,-1.27; 2 -3.81,1.27; 3 -1.27,-1.27; 4 -1.27,1.27; 5 1.27,-1.27; 6 1.27,1.27; 7 3.81,-1.27; 8 3.81,1.27
1206 = smd 1.6 x 1.803: A -1.422,0; C 1.422,0
1X06 = drill 1.016 long: 1 -6.35,0; 2 -3.81,0; 3 -1.27,0; 4 1.27,0; 5 3.81,0; 6 6.35,0
SOT223 = smd 1.219 x 2.235: 1 -2.311,-3.099; 2 0,-3.099; 3 2.311,-3.099 | smd 3.6 x 2.2: 4 0,3.099
HC49UP = smd 5.334 x 1.93: 1 -4.826,0; 2 4.826,0
CC4VCRYSTAL = smd 1.3 x 2.2: P$1 -2.5,0; P$2 1.7,0
SOT23-BEC = smd 1 x 1.4: B -0.95,-1.1; C 0,1.1; E 0.95,-1.1
M1206 = smd 1.6 x 2: 1 -1.4,0; 2 1.4,0
R1206 = smd 1.6 x 1.803: 1 -1.422,0; 2 1.422,0
R2512 = smd 1.8 x 3.2: 1 -2.8,0; 2 2.8,0
M09H = drill 1.016 octagon: 1 -5.486,1.27; 2 -2.743,1.27; 3 0,1.27; 4 2.743,1.27; 5 5.486,1.27; 6 -4.115,-1.27; 7 -1.372,-1.27; 8 1.372,-1.27; 9 4.115,-1.27 | hole 3.302: 12.522,0; -12.522,0
CR1220-SMD = smd 3.2 x 3.2: +$1 -8.2,0; +$2 8.2,0 | smd 3.9 x 3.9: - 0,0
HRS-MICROSD = smd 1 x 1.5: CASE1 5.95,1.9 | smd 2 x 3: CASE2 -5.7,-13 | smd 2.5 x 2: CASE3 8.8,-13.5 | smd 0.7 x 1.5: CLK 0,1.9; CMD 2.2,1.9; DAT0 -2.2,1.9; DAT1 -3.3,1.9; DAT2 4.4,1.9; DAT3 3.3,1.9; VDD 1.1,1.9; VSS -1.1,1.9
ARDUINO-NODIM = drill 1 pad 1.676 octagon: 3V -11.43,-25.4; 5V -8.89,-25.4; A0 3.81,-25.4; A1 6.35,-25.4; A2 8.89,-25.4; A3 11.43,-25.4; A4 13.97,-25.4; A5 16.51,-25.4; AREF -23.114,22.86; D0 16.51,22.86; D1 13.97,22.86; D2 11.43,22.86; D3 8.89,22.86; D4 6.35,22.86; D5 3.81,22.86; D6 1.27,22.86; D7 -1.27,22.86; D8 -5.334,22.86; D9 -7.874,22.86; D10 -10.414,22.86; D11 -12.954,22.86; D12 -15.494,22.86; D13 -18.034,22.86; GND -20.574,22.86; GND1 -3.81,-25.4; GND2 -6.35,-25.4; RESET -13.97,-25.4; VIN -1.27,-25.4
PTH08080WAH = drill 1.1 pad 1.93 round: P$1 1.8,9.7; P$2 1.8,6.2; P$3 1.8,2.7; P$4 14.3,1.7; P$5 14.3,11.4
TSSOP20 = smd 0.305 x 0.991: 1 -2.925,-2.918; 2 -2.275,-2.918; 3 -1.625,-2.918; 4 -0.975,-2.918; 5 -0.325,-2.918; 6 0.325,-2.918; 7 0.975,-2.918; 8 1.625,-2.918; 9 2.275,-2.918; 10 2.925,-2.918; 11 2.925,2.918; 12 2.275,2.918; 13 1.625,2.918; 14 0.975,2.918; 15 0.325,2.918; 16 -0.325,2.918; 17 -0.975,2.918; 18 -1.625,2.918; 19 -2.275,2.918; 20 -2.925,2.918
IM43GR = smd 0.7 x 2: COIL+ -4.3,-3.1; COIL- -4.3,2.9; S1COM 1.1,2.9; S1ON 3.3,2.9; S1RESET -1.1,2.9; S2COM 1.1,-3.1; S2ON 3.3,-3.1; S2RESET -1.1,-3.1

### Placement (x,y rotation side)
ADC(H)  96.52,58.57 180 top
ADCL  119.38,58.57 180 top
BREAKOUT  97,71.75 180 top
C1  135.24,89.25 90 top
C2  70.56,45.93 90 top
C3  162.45,92.48 180 top
C4  43.02,49.58 90 top
C5  44.27,32.3 180 top
C6  55,32.5 180 top
C7  148.24,82.69 90 top
C8  162.46,76.19 180 top
C9  148.62,89.25 90 top
C10  175.06,48.03 270 top
C11  32,65.25 0 top
C12  26,65.25 0 top
C13  36.75,58 90 top
C14  175.25,35.33 90 top
C15  22,58 270 top
C16  37.5,48.25 270 top
C17  73.25,70 90 top
C18  60.25,70 270 top
C19  39,41.75 180 top
C21  193.73,29.44 90 top
C23  163.88,35.72 180 top
COMMUNICATION  101.6,10.31 0 top
CON-CURRENT1  216,47.73 90 top
CON-CURRENT2  216,58.73 90 top
CON-EXT-IN  216,27.73 90 top
CON-RELAY1  216,92.66 90 top
CON-RELAY2  216,84.66 90 top
CON-RELAY3  216,76.66 90 top
CON-RELAY4  216,68.66 90 top
D2  5v  [C1206']  142.66,89.25 270 top
D4  47.5,79.75 180 top
F1  184,7.75 180 top
FTDI  38.5,30.75 90 top
GPS_BREAKOUT  33,89.75 90 top
GPS_POWER_SEL  25,90.75 90 top
HYMERA_COMMS  9.4,71.85 90 top
HYMERA_SERIAL  46.25,64.75 180 top
IC1  28.52,47.59 180 top
IC2  24.3,25.23 90 top
IC3  64.39,84.14 270 top
IC4  46.02,10.07 270 top
IC5  55.72,46.5 90 top
J1  18.2,84.85 270 top
J2  18.3,71.65 270 top
JP1  83.82,21.74 270 top
JP7  67.65,58.41 180 top
JP8  83.8,47.11 270 top
LCD_BREAKOUT  66.54,7.55 0 top
LED_168_STAUTS  66,36.25 0 top
LED_2540_STATUS_1  66,26.75 0 top
LED_2540_STATUS_2  66,18 0 top
POWER  139.7,58.57 180 top
POWER_IN  216,6.75 90 top
PWM(H)  146.05,10.31 0 top
PWM(L)  124.46,10.31 0 top
Q1  194.26,18.38 270 top
Q3  162.42,48.27 90 top
Q4  49.45,23.68 180 top
Q5  31.17,24.36 90 top
Q6  181.66,22.09 0 top
R1  183.99,15.71 180 top
R2  176.84,15.76 0 top
R3  66,33 0 top
R4  66,23.25 0 top
R5  32.5,35.25 180 top
R6  78.25,81.97 0 top
R7  54.12,10.23 270 top
R8  44.08,39.88 90 top
R9  22.5,35.25 0 top
R10  78.25,90.86 0 top
R11  138.06,82.66 90 top
R12  138.2,89.25 270 top
R13  176.69,87.16 0 top
R14  176.69,92.16 180 top
R15  176.69,77.16 0 top
R16  176.69,82.66 180 top
R17  200.47,38.87 90 top
R18  176.69,66.66 0 top
R19  176.69,71.66 180 top
R20  176.69,56.16 0 top
R21  176.69,61.66 180 top
R22  66,14.25 0 top
R23  48,86.75 180 top
R24  41.25,72.5 270 top
R25  48.5,72 270 top
SD_ACT  78.25,86.41 0 top
TELIT-POWERCON  216,16.75 90 top
TELIT_COMMS  9.2,26.25 270 top
U$1  27.36,10.22 180 top
U$2  89.58,85.02 90 top
U$3  132.08,39.52 180 top
U$4  180.78,38.88 0 top
U$5  162.45,86.48 270 top
U$6  191.81,92.34 0 top
U$7  191.81,81.84 0 top
U$8  191.81,70.84 0 top
U$9  191.81,60.34 0 top
U$10  [ARCOLALOGO20MM]  113,75.25 0 top

### Tracks (layer width: path | path; a pad name or v marks a point on that pad's centre or on a via)
12V_GSM  (via drill 0.41)
  Top 1.016: v193.2,18.35 191.2,18.35 Q1.2 | v142.6,50.15 v171,21.75
  Bottom 1.016: TELIT-POWERCON.P$1 207.4,18.95 204.4,21.95 196.8,21.95 v193.2,18.35 192.8,18.55 189.6,21.75 v171,21.75 | v142.6,50.15 141,51.75 130.8,51.75 130.8,62.35 133.2,64.75 U$3.VIN
168_RESET
  Top 0.203: C19.1 40.6,41.55 40.6,40.15 42,38.75 44,38.75 44,38.55 R8.1 44.2,38.55 45.8,38.55 48.4,41.15 48.4,46.15
  Top 0.254: 45.6,46.15 48.4,46.15 49.4,46.15 | 49.4,46.15 51.4,46.15 IC5.29 | 49.4,46.15 49.4,49.95 52.4,52.95 52.4,54.95 60.4,54.95 65,59.55 JP7.5
168_STATUS
  Top 0.254: IC5.9 60.2,43.55 64.4,39.35 64.4,36.35 LED_168_STAUTS.A
2540_STATUS_1  (via drill 0.41)
  Top 0.254: v66,25.35 64.6,26.75 LED_2540_STATUS_1.A
  Bottom 0.254: v66,25.35 82.2,25.35 82.4,25.55 JP1.5
2540_STATUS_2  (via drill 0.41)
  Top 0.254: v64.8,19.75 64.8,18.35 64.6,18.15 LED_2540_STATUS_2.A
  Bottom 0.254: v64.8,19.75 68.2,23.15 82.4,23.15 JP1.7
+3V3  (via drill 0.41)
  Top 1.016: POWER.2 143.6,58.75 143.6,64.75 U$3.3V 143.2,65.15 140.5,67.85 | v61.8,89.95 61.4,89.55 61.4,88.75 IC3.1 | 140.5,67.85 139,69.35 | v85.2,89.35 85.2,86.15 87.6,86.15 U$2.VDD | v134.6,79.55 140.8,73.35 140.8,68.15 140.5,67.85
  Bottom 1.016: 85.2,89.95 v61.8,89.95 61.4,89.75 55.2,83.55 29.6,83.55 25,88.15 GPS_POWER_SEL.1 | 85.2,89.95 86.2,89.95 86.6,89.75 87.8,88.55 125.6,88.55 v134.6,79.55 | 85.2,89.95 v85.2,89.35
+5V  (via drill 0.41)
  Top 0.254: U$5.1 159.53,90.35 159.53,90.96 C3.2
  Top 0.406: U$5.15 161.4,86.16 161.4,86.65
  Top 0.508: v29.6,36.15 30.6,35.15 R5.2 | R9.1 21.2,35.35 v21.2,36.95 21,36.95 2.6,55.35 v2.6,95.15 | 31.4,31.75 31.6,31.35 35.4,27.55 35.4,19.15 45.6,8.95 IC4.3 | C3.2 160.4,91.75 161.4,90.75 161.4,86.65 161.4,78.15 160.6,77.35 160.6,76.55 C8.+ | v69,91.15 74.6,85.55 74.6,84.15 76.4,82.35 76.4,82.15 R6.1 | 159.53,90.35 v159.6,90.35
  Top 1.016: 151.5,66.25 160,74.75 160,75.75 C8.+ | 151.5,66.25 v147.6,62.35 | CON-CURRENT1.P$1 208.8,49.95 211.6,52.75 211.6,57.75 208.8,60.55 208.8,60.75 CON-CURRENT2.P$1 | R14.1 178.2,92.15 178.2,87.55 R13.2 178.2,87.15 178.2,83.15 R16.1 178.2,82.55 178.2,77.35 R15.2 178.2,76.75 178.2,72.15 R19.1 178.2,71.55 178.2,67.15 R18.2 178.2,66.55 178.2,62.15 R21.1 178.2,61.55 178.2,58.15 | 178.2,58.15 178.2,56.35 R20.2 | Q3.2 165.6,48.35 172.4,48.35 v172.4,53.35 172,53.55 164.2,53.55 151.5,66.25 | 178.2,58.15 v177.6,58.15 | IC4.3 46,8.75 46,6.35 51.6,6.35 54,8.75 R7.2 54.6,8.75 55.4,8.75 56.8,10.15 56.8,10.75 63.6,10.75 65.2,9.15 65.2,7.55 LCD_BREAKOUT.2 | 31.4,31.75 31.4,34.55 31.2,34.75 R5.2 | v77,80.15 77,81.95 R6.1 | 24.8,93.35 25,93.35 GPS_POWER_SEL.3
  Bottom 0.508: v21.2,36.95 22,36.15 v29.6,36.15 | 28.7,97.05 29,97.35 62.8,97.35 63.1,97.05 | 28.7,97.05 25,93.35 GPS_POWER_SEL.3 | 63.1,97.05 v69,91.15 | v159.6,90.35 152.2,97.75 63.8,97.75 63.1,97.05 | v2.6,95.15 4.6,97.15 28.6,97.15 28.7,97.05
  Bottom 1.016: 141,62.35 141,64.75 U$3.5V | 141,62.35 141,58.75 POWER.3 | v147.6,62.35 141,62.35 | v172.4,53.35 177.2,58.15 v177.6,58.15 178,57.95 182.6,53.35 208.6,53.35 208.6,49.95 CON-CURRENT1.P$1 | v77,80.15 78.2,78.95 79.8,78.95 87,71.75 BREAKOUT.8
+5V/1  (via drill 0.4, 0.41, 0.6)
  Top 0.254: IC5.4 55.25,42.14 55.25,41.25 55.5,41 56.5,41 56.91,41.41 IC5.6 56.91,44.91 v57.25,45.25 | v57.25,47.25 57.25,48.75 57.75,49.25 57.75,50.76 IC5.18
  Top 0.406: IC5.18 57.75,50.79 v57.75,53.75 | 51.2,56.75 v57.75,56.75
  Top 1.016: 34.7,44.05 33.4,42.75 33,42.75 IC1.16 | 34.7,44.05 C16.2 38,46.75 40.6,46.75 40.6,46.55 42.4,44.75 42.8,44.75 | v29.2,33.55 24.2,28.55 24.2,22.75 21.8,22.75 21.4,23.15 IC2.8 | v32.8,37.15 35,39.35 35,43.75 34.7,44.05 | U$4.P$3 182.6,41.75 182.6,41.95 180.6,41.95 175.4,36.75 C14.2 174.8,36.55 169.2,36.55 169.2,37.15 168.2,38.15 162.2,38.15 | 162.2,38.15 162.2,35.95 161.8,35.55 C23.+ | 162.2,40.75 162.2,38.15 | 162.2,40.75 162.2,50.75 165.4,50.75 Q3.3 | R23.1 50.8,84.15 49.8,83.15 49.8,79.95 49.6,79.75 D4.C 49.8,79.35 51.2,77.95 51.2,56.75 51.2,55.15 44.2,48.15 43.4,48.15 C4.1 43,48.15 42.8,47.95 42.8,44.75 | v68.6,44.15 68.6,44.35 70.4,44.35 C2.1 | v46.9,41.95 43.8,41.35 44.1,41.35 R8.2 42.8,41.75 42.8,44.75 | v161.8,40.75 162.2,40.75
  Bottom 0.254: v57.25,47.25 v57.25,45.25
  Bottom 0.406: v57.75,56.75 v57.75,53.75
  Bottom 1.016: v29.2,33.55 v32.8,37.15 | v46.9,41.95 66.4,41.95 v68.6,44.15 69,43.95 72.2,40.75 v161.8,40.75
+12V  (via drill 0.41)
  Top 1.016: v185.2,13.75 185.2,15.35 R1.1 185.4,15.75 191,15.75 191,15.95 Q1.3 191.6,15.95 194.6,15.95 194.6,21.75 196.6,23.75 196.6,28.55 194,31.15 194,32.35 C21.+ 193.6,32.75 193.2,33.15 193.2,38.15 183,48.35 U$4.P$1 182.4,48.75 182.4,48.95 182.2,49.15 182.2,49.55 175.2,49.55 C10.1
  Bottom 1.016: v185.2,13.75 179.2,7.75 F1.2
ADC0  (via drill 0.41)
  Top 0.254: v129.6,48.15 129.6,57.35 128.4,58.55 ADCL.1
  Bottom 0.254: v129.6,48.15 130.6,47.15 173.6,47.15 188,32.75 204.2,32.75 207,29.95 208.6,29.95 CON-EXT-IN.P$1
ADC1  (via drill 0.41)
  Top 0.254: v140.4,50.55 v167.8,23.15
  Bottom 0.254: v140.4,50.55 129.6,50.55 129.6,54.75 125.8,58.55 ADCL.2 | v167.8,23.15 205.8,23.15 208,25.35 208.6,25.35 CON-EXT-IN.P$2
ADC2  (via drill 0.41)
  Top 0.254: v146.2,29.55 128.8,46.95 128.8,51.75 123.6,56.95 123.6,58.15 123.2,58.55 ADCL.3
  Bottom 0.254: v146.2,29.55 201.8,29.55 202,29.75 203.2,29.75 CON-EXT-IN.P$3
ADC8
  Bottom 0.254: BREAKOUT.1 105.8,71.75 105.8,58.75 105.6,58.75 ADC(H).1
ADC9
  Bottom 0.254: BREAKOUT.2 103.4,71.75 103.4,58.75 103,58.75 ADC(H).2
ADC10
  Bottom 0.254: BREAKOUT.3 100.8,58.75 100.4,58.75 ADC(H).3
ADC11
  Bottom 0.254: BREAKOUT.4 98.2,71.75 98.2,58.75 97.8,58.75 ADC(H).4
ADC12
  Top 0.254: BREAKOUT.5 95.8,71.75 95.8,59.95 95.4,59.55 95.4,58.75 ADC(H).5
ADC13
  Bottom 0.254: BREAKOUT.6 93.2,58.75 92.8,58.75 ADC(H).6
BATT_SENSE_IN  (via drill 0.41)
  Top 1.016: 133.5,68.65 130.8,65.95 130.8,47.15 v157.6,20.35 | 133.5,68.65 134.2,69.35 | R11.2 138,83.95 133.2,83.95 133.2,68.95 133.5,68.65
  Bottom 1.016: v157.6,20.35 180.8,20.35 193.4,7.75 F1.1 195.4,8.15 201.6,8.15 203,6.75 POWER_IN.P$2
BATT_SENSE_SAFE
  Top 0.254: 130,73.55 122,65.55 122,63.55 118.6,60.15 118.6,59.15 118.2,58.75 ADCL.5 | 130,73.55 131.2,74.75 | 138.2,87.95 135.4,87.95 C1.1 135.2,87.75 130,82.55 130,73.55 | 138.2,87.95 140.4,87.95 | 140.4,87.95 142.6,87.95 D2.CATHODE | 138.2,87.95 R12.2 | 140.4,87.95 140.4,81.35 138.2,81.35 R11.1
CAP_SENSE  (via drill 0.41)
  Top 0.254: v53.6,52.15 53.6,50.95 IC5.23 | v50,67.95 48.6,69.35 48.6,70.55 R25.2 48.4,70.75 48.4,70.95 41.4,70.95 R24.2
  Bottom 0.254: v53.6,52.15 50.8,54.95 50.8,67.95 v50,67.95
CURRENT_SENSE_1  (via drill 0.41)
  Top 0.254: v141.4,76.15 141.4,76.35 143.4,76.35 148.2,81.15 C7.1
  Bottom 0.254: ADCL.6 115.6,58.75 115.6,59.95 117.2,61.55 126.8,61.55 v141.4,76.15 165.4,52.15 196.6,52.15 203.2,45.55 CON-CURRENT1.P$4
CURRENT_SENSE_2  (via drill 0.41)
  Top 0.254: v150.4,71.95 150.4,85.75 150,86.15 150,86.55 148.8,87.75 C9.1
  Bottom 0.254: 121.6,67.15 116,67.15 113,64.15 113,63.75 | 113,63.75 113,58.75 ADCL.7 | 150.4,71.75 188,71.75 203.2,56.55 CON-CURRENT2.P$4 | 150.4,71.75 147,71.75 141.2,77.55 139,77.55 127,65.55 127,63.75 113,63.75 | 150.4,71.75 v150.4,71.95
DC_INHIBIT  (via drill 0.41)
  Top 0.254: v53.6,49.35 53,49.95 53,50.55 52.8,50.75 IC5.24
  Bottom 0.254: v53.6,49.35 53.8,49.55 85.6,49.55 86.2,48.95 179.6,48.95 181.6,50.95 194.2,50.95 194.8,50.35 195,50.35 U$4.P$5
DS18B20  (via drill 0.41)
  Top 0.254: R7.1 54,11.55 48.2,11.55 48.2,10.35 48,10.15 IC4.2 | v100,2.35 100,1.35 136.6,1.35 144.4,9.15 144.4,9.95 144.6,10.15 PWM(H).4
  Bottom 0.254: v100,2.35 97.8,4.55 53.8,4.55 48.4,9.95 48,9.95 IC4.2
GND  (via drill 0.4, 0.6)
  Top 0.254: IC5.3 54.52,43.77 55,44.25 | 55,44.25 55.75,44.25 56.25,43.75 56.25,42.34 IC5.5 | 55,44.25 55,44.5 v55.75,45.25 | v55.75,47.25 55.75,48.25 55.25,48.75 55.25,50.73 IC5.21 | U$5.18 164.4,88.11 163.75,88.75 163.75,92.38 C3.1 | v160.25,82.25 157,82.25 156.5,83 156.5,83.75 157,84.25 159.49,84.25 U$5.9 | U$5.12 164.75,84.2 164.3,83.75 164.3,83.05 v163.5,82.25
  Top 0.4: IC1.15 31.7,40.45 27.5,36.25 27.5,34 v26.25,32.75
  Top 0.406: U$1.- 27.36,12.11 v31,15.75 | v32.5,28 29.75,28 28.75,27 27.5,27 IC2.4 | JP7.6 65.11,56.36 v62.5,53.75 | v70.5,51.25 70.5,47.4 C2.2
  Bottom 0.254: v55.75,45.25 v55.75,47.25 | v160.25,82.25 v163.5,82.25
  Bottom 0.4: v26.25,32.75 26.25,32
  Bottom 0.406: v31,15.75 36,20.75 36,24.5 v32.5,28 | v62.5,53.75 64.5,53.75 65.5,52.75 69,52.75 v70.5,51.25
  pour Top (isolate 0.305): 4,97.75 215,97.75 215,2.25 3.5,2.25 3.5,97.5
  pour Bottom (isolate 0.406): 216,97.25 216,2 4.5,2 4.75,96
GPS_POWER
  Top 0.254: GPS_POWER_SEL.2 30.2,90.75 30.2,90.15 31.8,88.55 33,88.55 GPS_BREAKOUT.2
GPS_RX  (via drill 0.41)
  Top 0.254: v42.2,81.95 35.8,88.35 35.8,90.95 33,90.95 GPS_BREAKOUT.3 | v70,62.75 80.4,52.35 80.4,42.55 109.8,13.15 115,13.15 115,11.55 115.4,11.15 115.4,10.35 PWM(L).1
  Bottom 0.254: v42.2,81.95 61.4,62.75 v70,62.75
GPS_TX  (via drill 0.41)
  Top 0.254: v59.2,83.55 51.4,91.35 51.4,93.75 33,93.75 GPS_BREAKOUT.4 | v89,53.35 109.4,32.95 109.4,20.95 117.8,12.55 117.8,11.75 118,11.55 118,10.35 PWM(L).2
  Bottom 0.254: v59.2,83.55 67,75.75 73.8,75.75 89,60.55 v89,53.35
GSM_POWER
  Top 0.254: PWM(L).8 133.2,10.35 133.2,16.55 U$3.D7
GSM_POWER_FET  (via drill 0.41)
  Top 0.254: v138.8,2.35 138.8,1.35 171.2,1.35 177.6,7.75 177.6,15.15 178.2,15.75 R2.2
  Bottom 0.254: v138.8,2.35 133.8,7.35 127.4,7.35 125.8,8.95 125.8,10.15 PWM(L).5
GSM_RX
  Bottom 0.254: PWM(H).3 138.2,14.35 123.8,14.35 121.6,16.55 120.8,16.55 U$3.D2
GSM_TX
  Top 0.254: PWM(L).4 123,10.35 123,16.55 U$3.D3
HYMERA_9
  Top 0.254: HYMERA_COMMS.9 8.2,76.15 8.6,76.55 8.6,78.15 11,80.55 15.4,80.55 15.4,86.95 17,88.55 18.2,88.55 J1.4
HYMERA_232_RX  (via drill 0.41)
  Top 0.254: v23.4,54.15 24,53.55 24,52.55 IC1.8
  Bottom 0.254: v23.4,54.15 23.4,65.95 | 23.4,65.95 23.4,66.55 | HYMERA_COMMS.2 10.8,69.15 18.2,69.15 J2.2 18.4,68.95 18.6,68.75 20,68.75 22.8,65.95 23.4,65.95
HYMERA_232_TX  (via drill 0.41)
  Top 0.254: v25,50.75 25,52.15 25.2,52.35 IC1.7
  Bottom 0.254: 24.2,49.95 v25,50.75 25,67.35 | 25,67.35 25,67.75 | HYMERA_COMMS.3 10.8,71.75 11,71.55 18.2,71.55 J2.3 18.8,71.15 20.2,71.15 23.4,67.95 24.2,67.95 24.8,67.35 25,67.35
HYMERA_INHIBIT
  Bottom 0.254: HYMERA_COMMS.4 10.8,74.55 11.2,74.15 18.2,74.15 J2.4
HYMERA_LOW_GAS
  Bottom 0.254: HYMERA_COMMS.1 10.8,66.55 18.2,66.55 J2.1
HYMERA_REPROG_RX  (via drill 0.41)
  Top 0.254: v5.4,55.15 5.4,67.75 8,70.35 HYMERA_COMMS.7
  Bottom 0.203: 77,31.95 76.2,31.15 56.8,31.15 54.4,33.55 40.2,33.55 40,33.35 36.2,33.35 36,33.55 33,33.55 31.6,32.15 30.6,32.15 30.12,32.62
  Bottom 0.254: 76.6,32.35 77,31.95 82,26.95 86.2,26.95 102.8,10.35 COMMUNICATION.5 | HYMERA_COMMS.7 8,70.55 6,72.55 6,79.55 16,79.55 17.4,80.95 18.2,80.95 J1.1 | v5.4,55.15 19.2,41.35 19.2,34.25
  Bottom 0.4: 30.5,33 30.12,32.62 29.5,32 28.75,32 27.5,33.25 27.5,33.5 26.75,34.25 19.2,34.25 18.5,34.25
HYMERA_REPROG_TX  (via drill 0.41)
  Top 0.254: COMMUNICATION.6 105.4,10.15 105,9.75 105,8.55 97.8,1.35 2.6,1.35 2.6,2.15 v2.8,2.35
  Bottom 0.254: 5.8,69.95 3.8,71.95 3.8,80.35 12.8,80.35 16,83.55 18.2,83.55 J1.2 | 5.8,69.95 8,67.75 HYMERA_COMMS.6 | 5.8,69.95 2.8,66.95 v2.8,2.35
HYMERA_TTL_RX  (via drill 0.41)
  Top 0.203: v51.8,51.15 51.8,49.55 51.6,49.35 IC5.25 | v24.8,44.35 24.2,43.75 24.2,42.75 IC1.9 | v86.4,61.35 88.4,61.35 89.8,59.95 89.8,58.95 90,58.75 ADC(H).7 | v68.4,51.55 v72.4,55.55
  Bottom 0.203: 45.8,57.75 51.8,51.75 v51.8,51.15 54.2,51.15 54.8,51.75 63.6,51.75 63.8,51.55 v68.4,51.55 | 45.8,57.75 45.8,63.95 46.2,64.35 46.2,64.75 HYMERA_SERIAL.2 | v24.8,44.35 38.2,57.75 45.8,57.75 | v86.4,61.35 86,61.75 78.6,61.75 v72.4,55.55
HYMERA_TTL_TX  (via drill 0.41)
  Top 0.203: v51,50.35 50.4,49.75 50.4,48.95 50.6,48.75 50.6,48.55 51.4,48.55 IC5.26 | 44.6,56.75 v45.8,55.55 | 44.6,56.75 44.6,63.15 43.8,63.95 43.8,64.75 HYMERA_SERIAL.3 | 44.6,56.75 41.2,56.75 35.4,50.95 35.4,49.75 31.4,49.75 26.6,44.95 26.6,44.55 25.4,43.35 25.4,42.75 IC1.10 | v63.2,50.95 v66.8,54.55
  Bottom 0.203: v45.8,55.55 v51,50.35 54.4,50.35 55.2,51.15 63,51.15 v63.2,50.95 | v66.8,54.55 67,54.55 67.2,54.75 81.6,54.75 81.8,54.55 82.8,54.55 83,54.75 84.6,54.75 87.2,57.35 87.6,57.35 87.6,58.55 ADC(H).8
LCD_RX
  Bottom 0.254: LCD_BREAKOUT.3 68,7.55 70.8,10.35 83.4,10.35 86.6,7.15 106,7.15 107.8,8.95 107.8,10.15 COMMUNICATION.7
LCD_TX
  Bottom 0.254: LCD_BREAKOUT.4 70.4,7.55 71.6,6.35 107.8,6.35 110.4,8.95 110.4,10.15 COMMUNICATION.8
MEGA_168_SS  (via drill 0.41)
  Top 0.254: v61.4,47.55 60.2,47.55 IC5.14
  Bottom 0.254: v61.4,47.55 62.8,46.15 82.2,46.15 82.4,45.95 JP8.5
MEGA_POWER_FET  (via drill 0.41)
  Top 0.254: v68.4,46.95 68.4,46.15 60.2,46.15 IC5.12 | v163.6,46.35 165.4,46.35 165.4,46.15 Q3.1
  Bottom 0.254: v68.4,46.95 85.6,46.95 86.2,46.35 v163.6,46.35
MEGA_RESET  (via drill 0.41)
  Top 0.254: v61.4,45.35 60.2,45.35 IC5.11 | v134.2,45.55 146,57.35 146,58.55 POWER.1
  Bottom 0.254: v61.4,45.35 81.2,45.35 82,44.55 85.4,44.55 86.4,45.55 v134.2,45.55
MISO  (via drill 0.41)
  Top 0.254: v66.4,56.35 66.4,55.55 60.2,49.35 IC5.16 | 81.8,80.15 81.8,69.55 v80.2,67.95 85.6,62.55 85.6,56.95 87.2,55.35 87.2,48.55 85.2,48.55 JP8.4 | 81.8,80.15 81.8,82.75 | 81.8,80.15 83.4,81.75 83.4,82.75 87.6,82.75 U$2.DAT0
  Bottom 0.254: v66.4,56.35 66.4,58.15 67,58.15 67.4,58.55 69,58.55 69.8,59.35 | 69.8,59.35 70,59.55 JP7.1 69.8,59.35 | v80.2,67.95 71.6,59.35 69.8,59.35
MOSI  (via drill 0.41)
  Top 0.254: 67.6,48.55 67.6,56.95 JP7.4 67.6,57.15 66.4,58.35 66.4,60.15 62.8,63.75 62.8,75.15 59,78.95 59,81.95 60.4,83.35 61.2,83.35 IC3.5 61.4,83.35 62.2,83.35 63.8,84.95 63.8,92.95 | 67.6,48.55 67.6,48.35 60.2,48.35 IC5.15 | 67.6,48.55 v67.8,48.55 | 63.8,92.95 63.8,93.95 | U$5.5 158.44,86.81 158.25,87 158.2,86.95 157.6,87.55 154.8,87.55 154.8,86.95 154.4,86.55 150.8,86.55 150.8,91.95 146.4,96.35 65.2,96.35 65.2,94.35 63.8,92.95
  Bottom 0.254: v67.8,48.55 82.4,48.55 JP8.3
MOSI_3.3  (via drill 0.41)
  Top 0.254: v59.6,85.75 60.4,84.95 61.2,84.95 IC3.4 | v89.2,87.35 87.8,87.35 U$2.CMD
  Bottom 0.254: v59.6,85.75 61.2,87.35 80.2,87.35 v81.2,88.35 81.4,88.35 82.4,87.35 v89.2,87.35
N$1
  Bottom 1.016: C18.+ 60.4,72.55 73.2,72.55 C17.-
N$2
  Top 0.254: 182.4,17.75 182.4,15.75 R1.2 | 182.4,17.75 182.4,18.55 181.6,19.35 181.6,23.15 Q6.C | 182.4,17.75 184.4,19.75 184.4,20.75 191,20.75 Q1.1
N$3
  Top 0.203: C19.2 37.8,41.55 37.8,39.15 38.4,38.55 38.4,37.15 FTDI.1
N$4
  Top 0.254: U$6.S2ON 195.2,89.35 208.4,89.35 208.4,92.35 208.6,92.55 CON-RELAY1.P$1
N$5
  Top 0.254: R17.1 200.4,37.55 195.2,37.55 195.2,40.55 U$4.P$4
N$6
  Top 0.406: IC2.1 31.17,23.32 Q5.P$1
N$7  (via drill 0.4)
  Top 0.406: IC2.3 25.61,25.86 25.5,25.75 25.5,21.5 v25,21 | v19.25,15.5 19.25,10.31 U$1.+$2 19.16,5.75 35.5,5.75 35.5,10.22 U$1.+$1
  Bottom 0.406: v25,21 24.75,21 v19.25,15.5
N$8
  Top 0.254: IC5.8 58.4,42.15 58.4,41.15 56.4,39.15 C6.1 56.4,25.75 54.4,23.75 Q4.1
N$9
  Top 0.406: IC2.2 31.17,24.59 Q5.P$2
N$10  (via drill 0.41)
  Top 0.254: v76.6,84.75 76.6,86.15 76.8,86.35 SD_ACT.A | v69.2,81.75 68.4,80.95 67.6,80.95 IC3.10
  Bottom 0.254: v76.6,84.75 73.6,81.75 v69.2,81.75
N$11
  Top 0.254: IC5.7 57.6,42.15 57.6,41.35 48.8,32.55 45.8,32.55 45.8,32.35 C5.1 45.6,32.15 45.6,24.55 44.8,23.75 Q4.2
N$12
  Top 0.254: U$6.S2COM 193,89.35 196,92.35 203,92.35 203,92.55 CON-RELAY1.P$2
N$13
  Top 0.254: R3.2 67.6,33.15 67.6,36.15 LED_168_STAUTS.C
N$14
  Top 0.254: U$7.S2ON 195.2,78.75 198.4,81.95 208.4,81.95 208.4,84.35 208.6,84.55 CON-RELAY2.P$1
N$15
  Top 0.254: U$7.S2COM 193,78.75 198.6,84.35 203,84.35 203,84.55 CON-RELAY2.P$2
N$16
  Top 0.254: U$8.S2ON 195.2,67.75 201.4,73.95 208.4,73.95 208.4,76.35 208.6,76.55 CON-RELAY3.P$1
N$17
  Top 0.254: U$8.S2COM 193,67.75 202,76.75 203,76.75 CON-RELAY3.P$2
N$18
  Top 0.254: SD_ACT.C 79.8,86.55 79.8,90.75 R10.2
N$19
  Top 0.254: U$9.S2ON 195.2,57.35 206.2,68.35 208.6,68.35 208.6,68.55 CON-RELAY4.P$1
N$20
  Top 0.254: U$9.S2COM 193,57.35 203,67.35 203,68.55 CON-RELAY4.P$2
N$21
  Top 0.254: 175.2,89.35 165.5,89.4 U$5.20 | 175.2,89.35 175.2,87.35 R13.1 | 175.2,89.35 175.2,89.75 176.4,90.95 176.4,92.95 177,93.55 183.2,93.55 U$6.COIL+
N$22  (via drill 0.4, 0.6)
  Top 0.254: U$6.COIL- 187.4,95.15 187.4,94.75 177.2,94.75 175.6,93.15 175.6,92.55 175.4,92.35 R14.2 172.16,92.16 v170.25,90.55 | v168.75,88.5 166.75,88.5 166.5,88.75 U$5.19
  Bottom 0.254: v170.25,90.55 170.25,90 v168.75,88.5
N$23  (via drill 0.41)
  Top 0.254: 175.2,78.75 173,80.95 173,87.45 165.4,87.45 U$5.17 | 175.2,78.75 175.2,77.35 R15.1 | v186.4,78.75 187.4,78.75 U$7.COIL+ | v175.4,78.95 175.2,78.75
  Bottom 0.254: v186.4,78.75 186.2,78.95 v175.4,78.95
N$24  (via drill 0.41)
  Top 0.254: v166.6,86.35 166.2,86.75 166,86.75 U$5.16 | v173.8,83.95 175.2,82.55 R16.2 | v186.4,84.55 187.4,84.55 U$7.COIL-
  Bottom 0.254: v166.6,86.35 169,83.95 v173.8,83.95 185.8,83.95 v186.4,84.55
N$25  (via drill 0.41)
  Top 0.254: 175.2,68.15 172.2,71.15 172.25,85.5 165.5,85.5 U$5.14 | 175.2,68.15 175.2,66.75 R18.1 | v186.4,67.75 187.4,67.75 U$8.COIL+ | v175.4,68.35 175.2,68.15
  Bottom 0.254: v186.4,67.75 185.8,68.35 v175.4,68.35
N$26  (via drill 0.41)
  Top 0.254: v164.2,84.95 165,84.95 | v175.6,73.55 175.4,73.35 175.4,71.75 R19.2 | v179.8,73.55 187.4,73.55 U$8.COIL-
  Top 0.406: U$5.13 164.2,84.86 v164.2,84.95
  Bottom 0.254: v164.2,84.95 v175.6,73.55 v179.8,73.55
N$27
  Top 0.254: U$5.11 165.4,83.55 168.8,80.15 168.8,64.15 175.2,57.75 175.2,56.35 R20.1 175.4,56.15 175.4,53.15 178.6,53.15 182.4,56.95 182.4,57.15 187.4,57.15 U$9.COIL+
N$28  (via drill 0.4, 0.41)
  Top 0.254: v169.6,72.55 173.2,68.95 173.2,65.15 175.2,63.15 175.2,61.75 R21.2 175.4,61.55 175.4,58.55 176,57.95 176,57.75 176.4,57.35 176.4,53.95 178.2,53.95 187.4,63.15 U$9.COIL- | U$5.10 159.6,83.55 158.05,83.55 v157.75,83.25
  Bottom 0.254: v157.75,83.25 157.75,81.5 158.75,80.5 161.65,80.5 v169.6,72.55
N$30
  Top 0.254: C12.1 24.6,65.15 25.4,64.35 25.4,55.95 27.8,53.55 27.8,52.55 IC1.5
N$31
  Top 0.254: C12.2 27.4,65.15 28.8,63.75 28.8,53.55 29.2,53.15 29.2,52.55 IC1.4
N$32
  Top 0.254: C11.1 30.6,52.55 IC1.3
N$33
  Top 0.254: C11.2 33.4,65.15 33.2,64.95 33.2,53.55 32.8,53.15 32.8,52.55 IC1.1
N$34
  Top 0.254: C13.1 36.6,56.55 34.6,54.55 34.6,52.15 33.6,51.15 32.2,51.15 32.2,51.55 31.8,51.95 31.8,52.35 IC1.2
N$35
  Top 0.254: C15.2 22,56.55 24,56.55 24,56.35 26.6,53.75 26.6,52.55 IC1.6
N$36
  Top 0.254: R4.2 67.6,23.35 67.6,26.75 LED_2540_STATUS_1.C
N$38
  Top 0.254: R22.2 67.6,14.35 67.6,17.95 LED_2540_STATUS_2.C
Q6BASE
  Top 0.254: Q6.B 180.6,20.95 177.8,18.15 175.6,18.15 175.6,15.95 R2.1
RELAY_CS  (via drill 0.4, 0.41)
  Top 0.254: 117.28,72.28 108,63 108,49.75 v102.25,44 | 117.28,72.28 117.75,72.75 | v92.75,43 90.25,43 86.75,39.5 86.33,39.5 JP8.7 | 159.53,87.5 U$5.4 158.7,87.45 157.9,88.25 v153.75,88.25 | v131,86.95 117.2,73.15 117.2,72.35 117.28,72.28
  Bottom 0.254: 149.6,88.25 149.5,88.25 | 149.6,88.25 v153.75,88.25 | v102.25,44 93.75,44 v92.75,43 | v131,86.95 148.4,86.95 149.6,88.15 149.6,88.25
RX  (via drill 0.41)
  Top 0.203: IC5.31 51.6,44.35 52.2,44.35 52.4,44.15 52.4,43.15 49.2,39.95 49.2,39.15 44.4,34.35 41,34.35 38.6,31.95 FTDI.3 | v65.4,21.55 v66.6,20.35
  Bottom 0.203: v66.6,20.35 82.4,20.35 JP1.9 | v65.4,21.55 55,31.95 38.6,31.95 FTDI.3
SCK  (via drill 0.41)
  Top 0.254: v59.8,54.15 59.8,52.15 58.6,50.95 IC5.17 | IC3.9 67.6,79.55 67.8,79.35 v67.8,78.55 67.8,59.75 JP7.3 | v63,85.35 62.4,85.95 61.4,85.95 IC3.3 | v157.45,86.15 159.4,86.15 U$5.6
  Bottom 0.254: v59.8,54.15 62.85,57.2 | 62.85,57.2 64.2,58.55 65.8,58.55 66.8,59.55 67.6,59.55 JP7.3 | v63,85.35 67.8,80.55 v67.8,78.55 | v157.45,86.15 153.3,81.75 153.2,81.75 149.8,78.35 125,78.35 108.2,61.55 108.2,59.75 107.6,59.75 | 107.6,59.75 107.6,51.15 85.4,51.15 | 107.6,59.75 107.6,60.15 | 85.4,51.15 85.2,50.95 JP8.2 85.4,51.15 | 85.4,51.15 83.4,53.15 70.6,53.15 69.9,53.85 67.4,53.85 67.2,53.65 66.4,53.65 62.85,57.2
SCK_3.3  (via drill 0.41)
  Top 0.254: v63,86.55 62.2,87.35 61.4,87.35 IC3.2 | v86.2,84.95 87.6,84.95 U$2.CLK
  Bottom 0.254: v86.2,84.95 85.4,85.75 78.2,85.75 77.4,86.55 75.8,86.55 75,85.75 65.2,85.75 64.4,86.55 v63,86.55
SCL  (via drill 0.41)
  Top 0.254: v33.6,31.55 33.6,34.95 33.8,35.15 R5.1 | v23,26.95 22,25.95 21.4,25.95 IC2.6
  Bottom 0.203: 32.6,30.55 33.4,29.75 34.8,29.75 35.6,30.55 36.8,30.55 37,30.75 40,30.75 46.8,23.95 46.8,18.95
  Bottom 0.254: v33.6,31.55 32.6,30.55 30.4,28.35 24.4,28.35 v23,26.95 | 46.2,18.95 46.8,18.95 79.8,18.95 82,16.75 86.2,16.75 92.6,10.35 COMMUNICATION.1
SD_SEL  (via drill 0.41)
  Top 0.254: 79.4,77.75 79.4,59.95 79,59.55 79,55.15 82.4,51.75 82.4,50.95 JP8.1 | 79.4,77.75 79.4,81.75 79.6,81.95 R6.2 | v63,80.95 61.4,80.95 IC3.7 | 79.4,77.75 v79.2,77.75
  Bottom 0.254: v63,80.95 66.2,77.75 v79.2,77.75
SD_SEL_3.3
  Top 0.254: 77,93.15 85,93.15 | 85,93.15 85.6,93.15 | 77,93.15 77,90.95 R10.1 | 77,93.15 68.8,93.15 65.2,89.55 65.2,82.15 61.4,82.15 IC3.6 | 85,93.15 85,91.15 86.6,89.55 86.6,88.35 87.6,88.35 U$2.DAT3
SDA
  Top 0.254: R9.2 23.8,35.15 23.4,34.75 23.4,29.95 21.4,27.95 21.4,27.15 IC2.5 21.2,27.15 20.4,27.15 18.8,25.55 18.8,19.35 31.4,19.35 38.4,12.35 38.4,4.75 90.8,4.75 94.8,8.75 94.8,9.75 95.2,10.15 COMMUNICATION.2
TELIT_232_RX
  Top 0.254: 22.6,36.15 22.4,35.95 22.4,34.35 | 22.6,36.15 22.8,36.35 22.8,36.55 23.8,36.55 28.6,41.35 28.6,42.15 29,42.55 IC1.13 | 22.6,36.15 22.6,32.75 14.2,32.75 10.6,29.15 TELIT_COMMS.2
TELIT_232_TX  (via drill 0.4)
  Top 0.254: IC1.14 30.4,42.55
  Top 0.4: IC1.14 30.5,42.62 30.5,41 26,36.5 26,34.25 v24.5,32.75
  Bottom 0.254: TELIT_COMMS.3 10.6,26.35 11,26.75 11.4,26.75 17.2,32.55 24.4,32.55 v24.5,32.75
  Bottom 0.4: v24.5,32.75 24.5,31.78
TELIT_TTL_RX  (via drill 0.41)
  Top 0.254: v28.4,44.35 28.4,43.15 28,42.75 IC1.12 | v78.2,39.15 97.8,19.55 97.8,10.35 COMMUNICATION.3
  Bottom 0.203: 33.2,39.55 34,40.35 45.8,40.35 46.4,39.75 77.8,39.75 78.2,39.35 v78.2,39.15
  Bottom 0.254: v28.4,44.35 33.2,39.55 33.6,39.15
TELIT_TTL_TX  (via drill 0.41)
  Top 0.254: v27,40.95 27,42.35 26.8,42.55 IC1.11 | v100.4,14.35 100.4,10.35 COMMUNICATION.4
  Bottom 0.203: 29.2,38.75 30,39.55 32.2,39.55 34,37.75 35,37.75 36.6,39.35 45.8,39.35 48,37.15 71.4,37.15 72.2,37.95
  Bottom 0.254: v27,40.95 29.2,38.75 29.6,38.35 | 71.8,38.35 72.2,37.95 80.8,29.35 85.4,29.35 v100.4,14.35
TX  (via drill 0.41)
  Top 0.203: IC5.30 51.4,45.15 50.6,45.15 49,43.55 49,40.75 46.2,37.95 46.2,37.15 44.2,35.15 40.6,35.15 40.2,34.75 38.6,34.75 FTDI.2 | v69.6,31.95 69.6,30.55 82,18.15 82,17.95 82.4,17.95 JP1.11
  Bottom 0.203: v69.6,31.95 67,34.55 38.6,34.55 FTDI.2
X  (via drill 0.41)
  Top 0.254: 45.2,79.95 45.4,79.75 D4.A | 45.2,80.35 R23.2 | 45.2,79.95 45.2,80.35 | 45.2,79.95 45.2,77.75 41.4,73.95 R24.1 | 45.2,79.95 D4.A | 45.2,80.35 v47,78.55 | 45.2,80.35 D4.A
  Bottom 0.254: v47,78.55 55.6,69.95 70.8,69.95 73.2,67.55 C17.+

### Text on the board
tNames: r1 | r2 | r3 | REMOTE FUEL CELL MONITORING SYSTEM | r4 | v0.2 c2013 www.arcolaenergy.com | tx | rx | c2 | c1 | ext | telit | +12v